# EAGLE board swift-nav (EAGLE 6.2), part 1 of 2
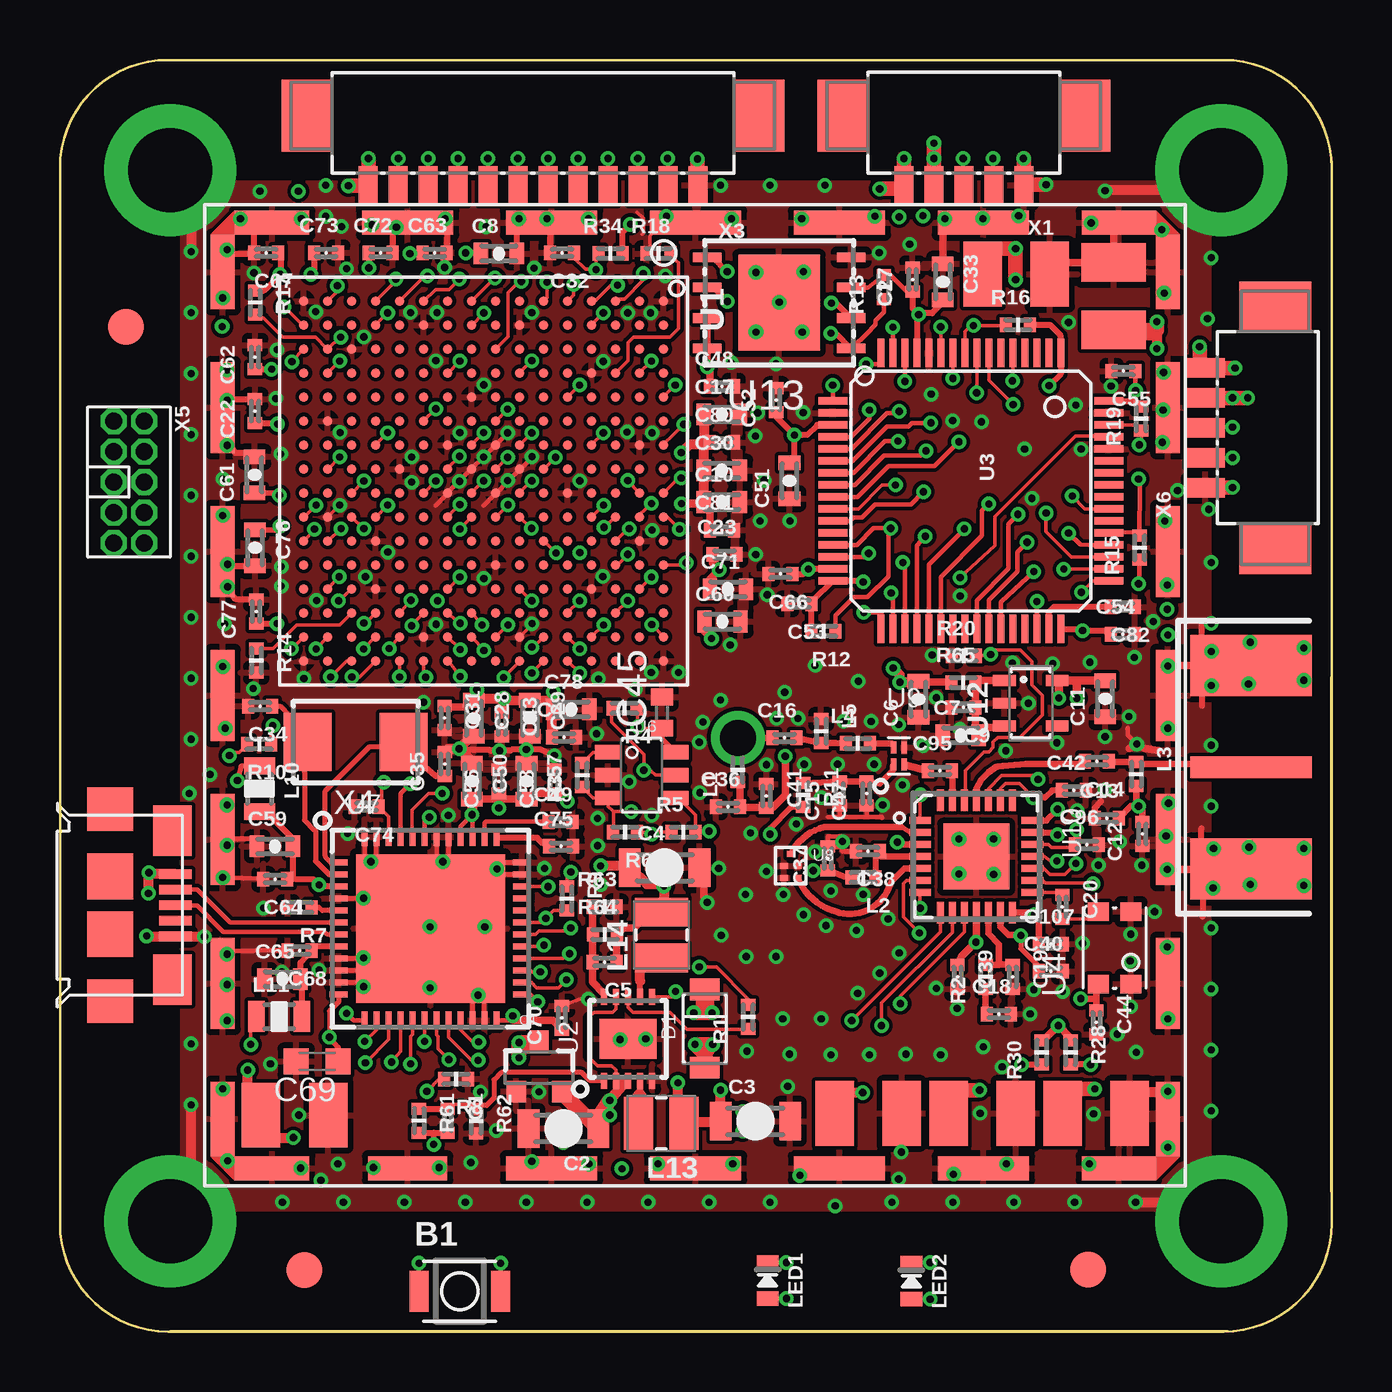
[diagram p7: board, top side]
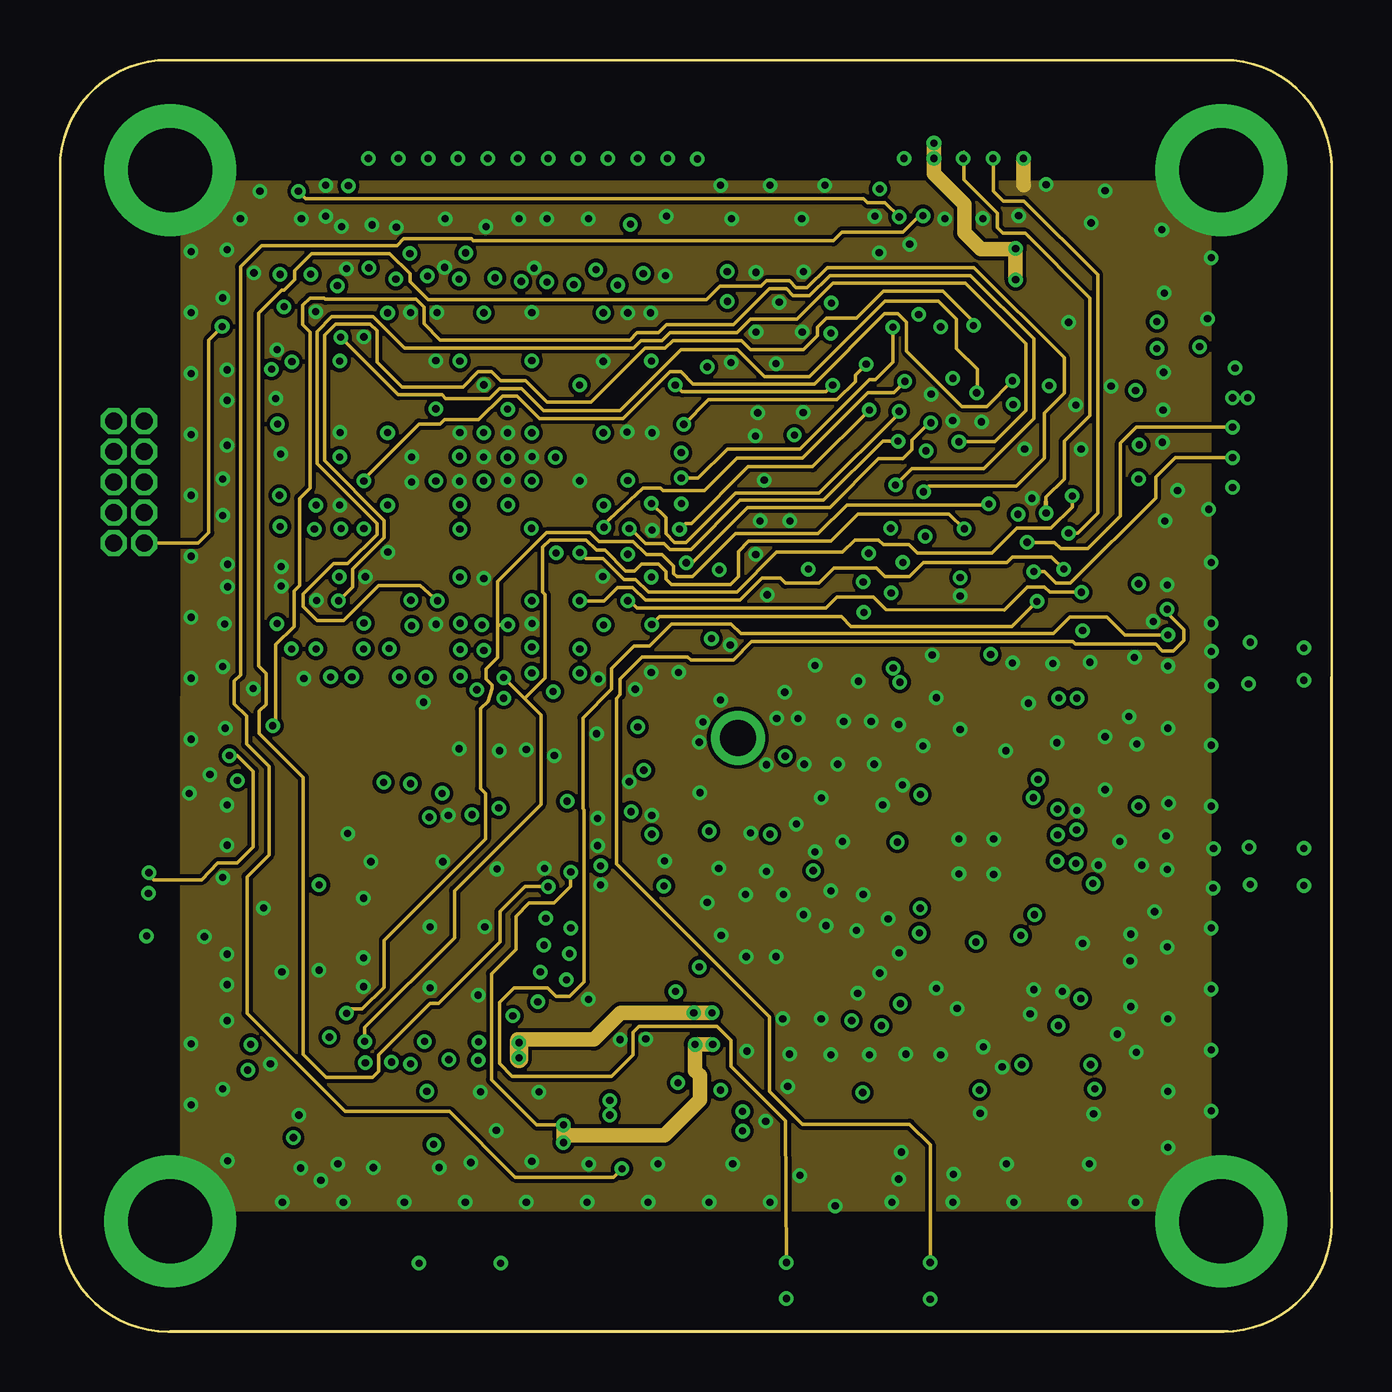
[diagram p8: board, inner layer Route2]
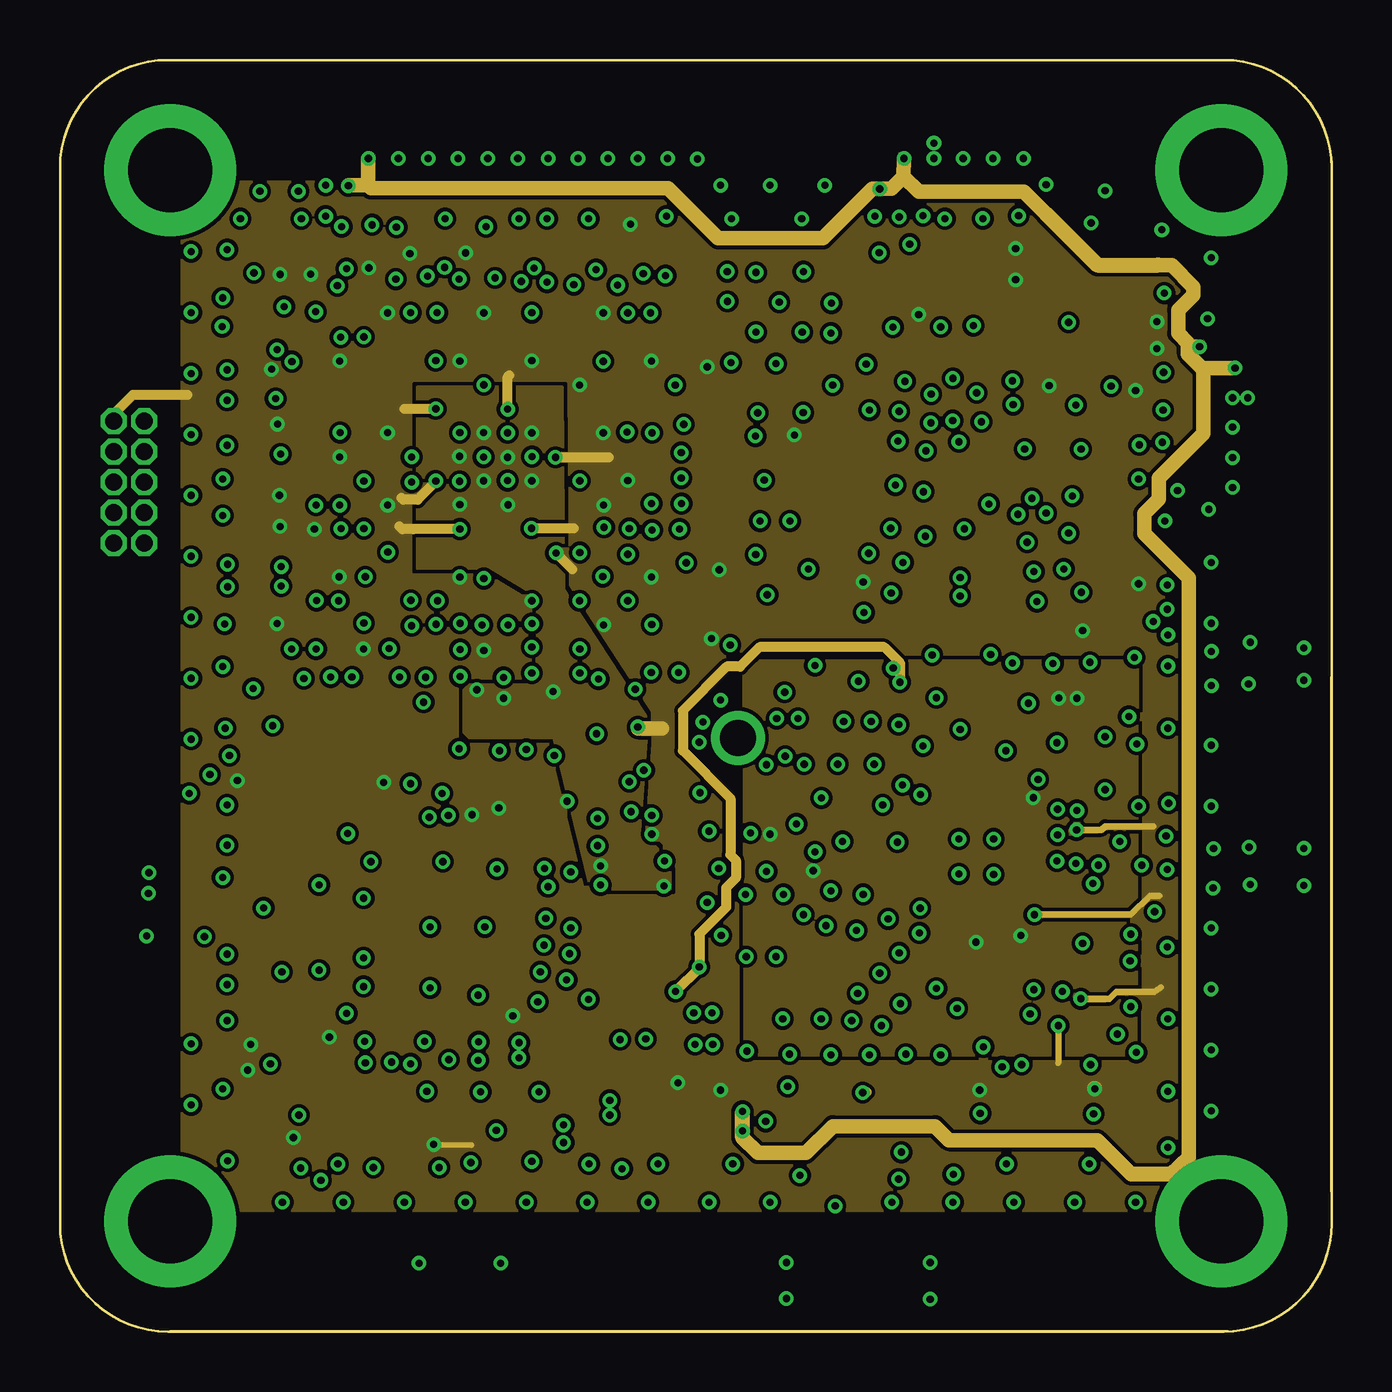
[diagram p9: board, inner layer Route3]
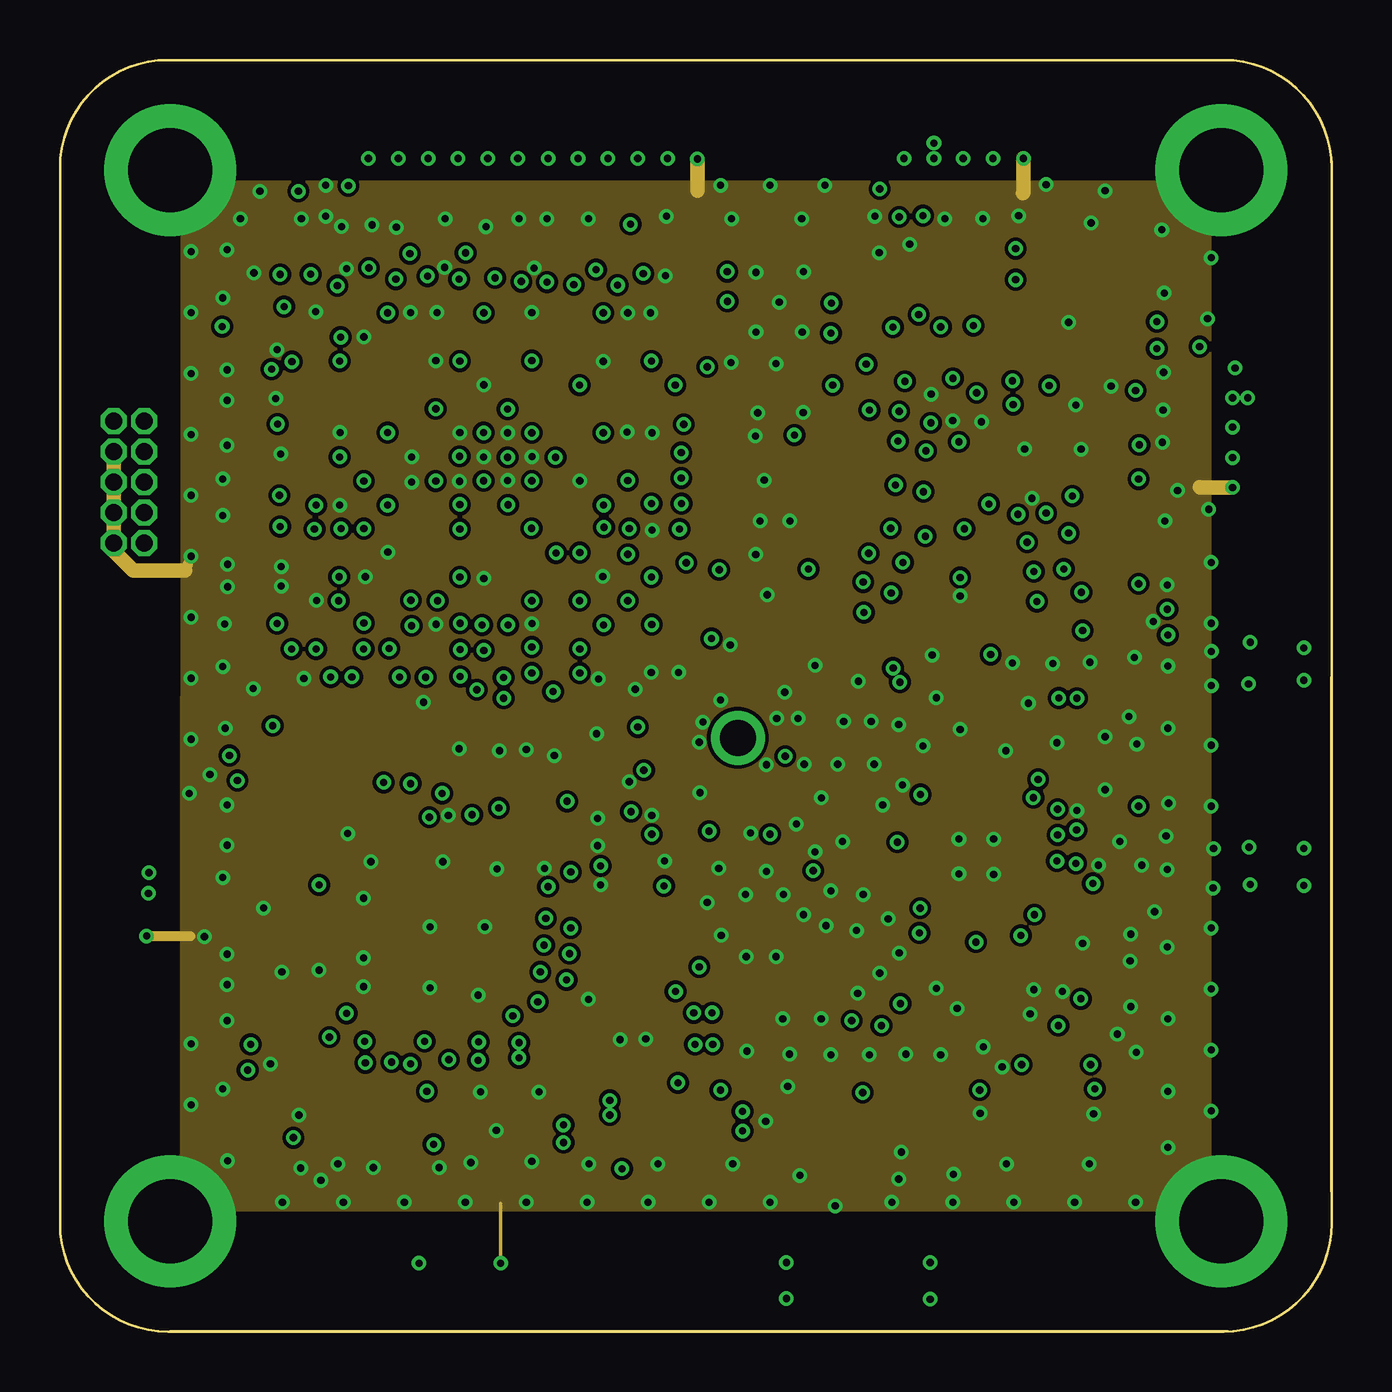
[diagram p10: board, inner layer Route14]
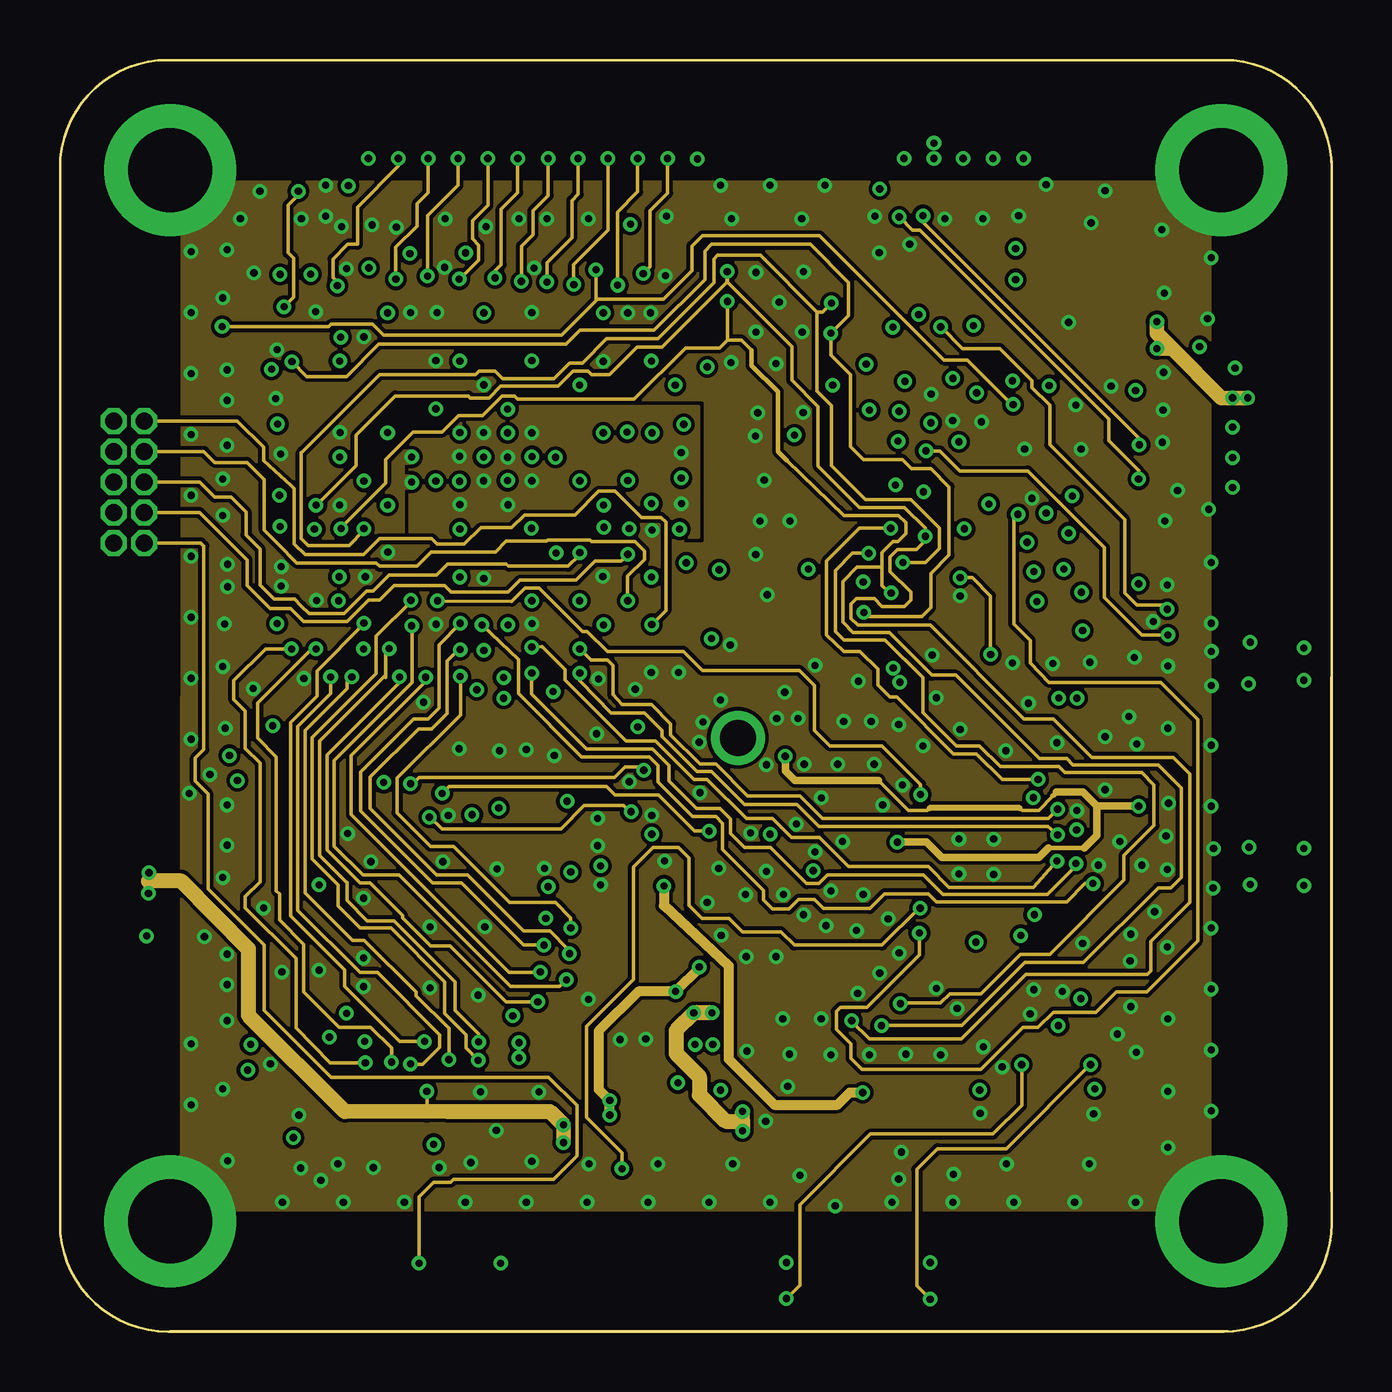
[diagram p11: board, inner layer Route15]
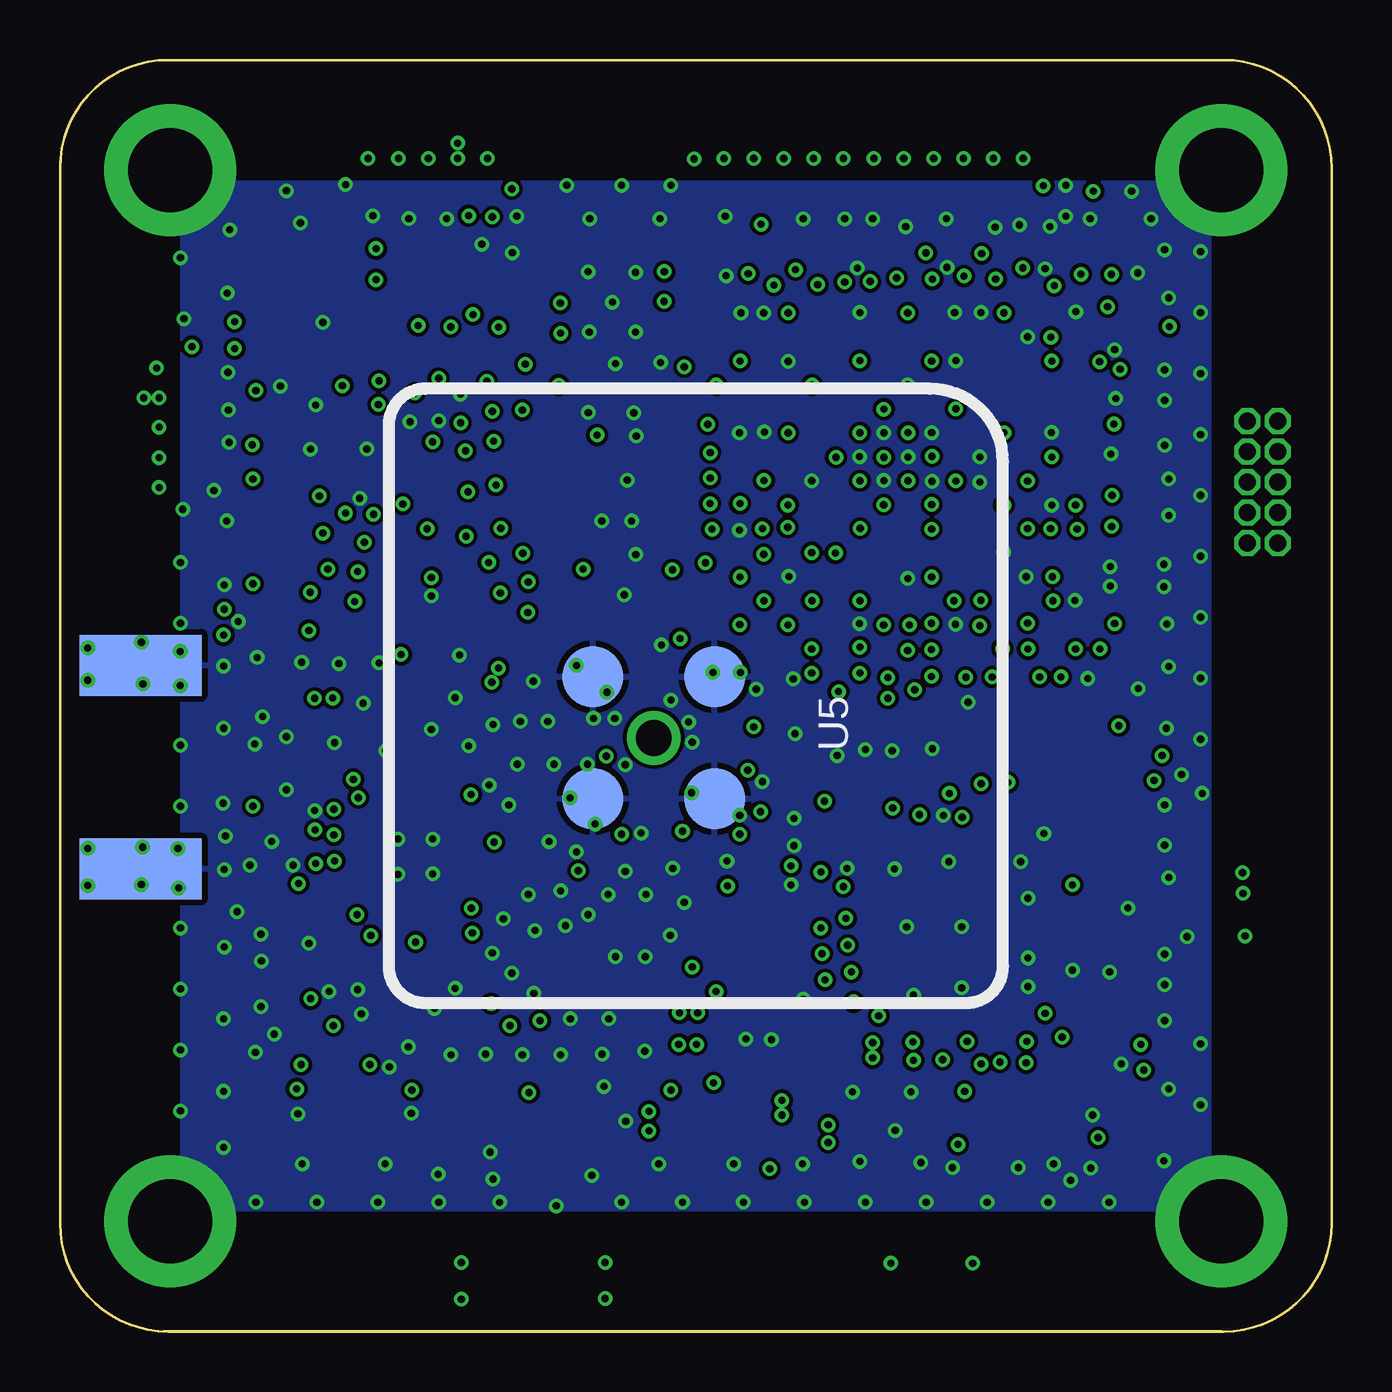
[diagram p12: board, bottom side, seen from below]

Size 53 x 53 mm. Coordinates in mm from the lower left corner, seen from the top.
Outline: 48.67,53 4.6,53
Outline: 0,47.3 0,5.86
Outline: 4.6,0 48.68,0
Outline: 53,5.85 53,48.76
Outline: 4.5,53 48.5,53 arc-90 53,48.5 53,4.5 arc-90 48.5,0 4.5,0 arc-90 0,4.5 0,48.5 arc-90 4.5,53
Copper layers (1+2*3+14*15+16): Top 0.0175mm / dielectric 0.15mm / Route2 0.0175mm / dielectric 0.5mm / Route3 0.0175mm / dielectric 0.15mm / Route14 0.0175mm / dielectric 0.5mm / Route15 0.0175mm / dielectric 0.15mm / Bottom 0.0175mm
Design rules: minimum track width 6mil, minimum drill 0.3mm, track to track 6mil, track to pad 6mil, pad to pad 6mil, via to via 6mil, smd to smd 6mil, copper to edge 30mil, drill to drill 8mil, minimum pad ring 7.5mil, minimum via ring 6mil, stop-mask expansion 3mil, vias tented up to drill 0.4mm, thermal gap 10mil

## Footprints (pad centres in the part's own frame; a part is rotated, then mirrored left to right if it is on the bottom)
B3U-1000P = smd 0.8 x 1.7: P$1 -1.7,0; P$2 1.7,0
0402-CAP = smd 0.5 x 0.6: P$1 -0.5,0; P$2 0.5,0
1206-CAP = smd 0.9 x 1.6: P$1 -1.45,0; P$2 1.45,0
0603-CAP = smd 0.6 x 0.9: P$1 -0.75,0; P$2 0.75,0
C1210 = smd 1.6 x 2.7: P$1 -1.4,0; P$2 1.4,0
C0402 = smd 0.7 x 0.9: 1 -0.65,0; 2 0.65,0
C0603K = smd 1.05 x 1.08: 1 -0.875,0; 2 0.875,0
SOD-123 = smd 0.914 x 1.219: 1 -1.626,0; 2 1.626,0
M3-PAD = drill 3.5 pad 5.5: B3,0 0,0
SMA_EDGE = smd 0.889 x 5.08: P1 0,-2.54 | smd 2.54 x 5.08: P2 -4.242,-2.54; P3 4.242,-2.54 | smd 2.54 x 5.08 bottom: P4 -4.242,-2.54; P5 4.242,-2.54
ZX62-B-5PA = smd 1.8 x 1.9: GND_LEFT -4,0; GND_RIGHT 4,0 | smd 1.9 x 1.9: GND_MID_LEFT -1.2,0; GND_MID_RIGHT 1.2,0 | smd 2.1 x 1.6: GND_UP_LEFT -3.1,2.6; GND_UP_RIGHT 3.1,2.6 | smd 0.4 x 1.35: PIN_1 -1.3,2.725; PIN_2 -0.65,2.725; PIN_3 0,2.725; PIN_4 0.65,2.725; PIN_5 1.3,2.725
FIDUCIAL-1.5X3 = smd 1.5 x 1.5: 1 0,0
0402-IND = smd 0.5 x 0.6: P$1 -0.5,0; P$2 0.5,0
0805-IND = smd 0.7 x 1.3: P$1 -0.95,0; P$2 0.95,0
LQM2HPN4R7MG0L = smd 1.2 x 2.2: 1 -0.95,0; 2 0.95,0
0603-LED = smd 0.6 x 0.9: A 0.75,0; C -0.75,0
SOT23-3 = smd 0.8 x 0.9: 1 -0.95,-1; 2 0.95,-1; 3 0,1.1
0402-RES = smd 0.5 x 0.6: P$1 -0.5,0; P$2 0.5,0
BMI-S-208 = smd 3.1 x 1: 1 2.55,0.5; 3 37.85,0.5; 7 37.85,39.9; 9 2.55,39.9 | smd 3.8 x 1: 2 8.2,0.5; 8 8.2,39.9; 13 14.2,0.5; 14 20.2,0.5; 15 26.2,0.5; 16 32.2,0.5; 25 14.2,39.9; 26 20.2,39.9; 27 26.2,39.9; 28 32.2,39.9 | smd 1 x 3.1: 4 39.9,2.55; 6 39.9,37.85; 10 0.5,37.85; 12 0.5,2.55 | smd 1 x 3.3: 5 39.9,8.2 | smd 1 x 3.8: 11 0.5,8.2; 17 39.9,14.2; 18 39.9,20.2; 19 39.9,32.2; 20 0.5,14.2; 21 39.9,26.2; 22 0.5,20.2; 23 0.5,26.2; 24 0.5,32.2
FT256 = smd 0.4 x 0.4: A1 -7.5,7.5; A2 -6.5,7.5; A3 -5.5,7.5; A4 -4.5,7.5; A5 -3.5,7.5; A6 -2.5,7.5; A7 -1.5,7.5; A8 -0.5,7.5; A9 0.5,7.5; A10 1.5,7.5; A11 2.5,7.5; A12 3.5,7.5; A13 4.5,7.5; A14 5.5,7.5; A15 6.5,7.5; A16 7.5,7.5; B1 -7.5,6.5; B2 -6.5,6.5; B3 -5.5,6.5; B4 -4.5,6.5; B5 -3.5,6.5; B6 -2.5,6.5; B7 -1.5,6.5; B8 -0.5,6.5; B9 0.5,6.5; B10 1.5,6.5; B11 2.5,6.5; B12 3.5,6.5; B13 4.5,6.5; B14 5.5,6.5; B15 6.5,6.5; B16 7.5,6.5; C1 -7.5,5.5; C2 -6.5,5.5; C3 -5.5,5.5; C4 -4.5,5.5; C5 -3.5,5.5; C6 -2.5,5.5; C7 -1.5,5.5; C8 -0.5,5.5; C9 0.5,5.5; C10 1.5,5.5; C11 2.5,5.5; C12 3.5,5.5; C13 4.5,5.5; C14 5.5,5.5; C15 6.5,5.5; C16 7.5,5.5; D1 -7.5,4.5; D2 -6.5,4.5; D3 -5.5,4.5; D4 -4.5,4.5; D5 -3.5,4.5; D6 -2.5,4.5; D7 -1.5,4.5; D8 -0.5,4.5; D9 0.5,4.5; D10 1.5,4.5; D11 2.5,4.5; D12 3.5,4.5; D13 4.5,4.5; D14 5.5,4.5; D15 6.5,4.5; D16 7.5,4.5; E1 -7.5,3.5; E2 -6.5,3.5; E3 -5.5,3.5; E4 -4.5,3.5; E5 -3.5,3.5; E6 -2.5,3.5; E7 -1.5,3.5; E8 -0.5,3.5; E9 0.5,3.5; E10 1.5,3.5; E11 2.5,3.5; E12 3.5,3.5; E13 4.5,3.5; E14 5.5,3.5; E15 6.5,3.5; E16 7.5,3.5; F1 -7.5,2.5; F2 -6.5,2.5; F3 -5.5,2.5; F4 -4.5,2.5; F5 -3.5,2.5; F6 -2.5,2.5; F7 -1.5,2.5; F8 -0.5,2.5; F9 0.5,2.5; F10 1.5,2.5; F11 2.5,2.5; F12 3.5,2.5; F13 4.5,2.5; F14 5.5,2.5; F15 6.5,2.5; F16 7.5,2.5; G1 -7.5,1.5; G2 -6.5,1.5; G3 -5.5,1.5; G4 -4.5,1.5; G5 -3.5,1.5; G6 -2.5,1.5; G7 -1.5,1.5; G8 -0.5,1.5; G9 0.5,1.5; G10 1.5,1.5; G11 2.5,1.5; G12 3.5,1.5; G13 4.5,1.5; G14 5.5,1.5; G15 6.5,1.5; G16 7.5,1.5; H1 -7.5,0.5; H2 -6.5,0.5; H3 -5.5,0.5; H4 -4.5,0.5; H5 -3.5,0.5; H6 -2.5,0.5; H7 -1.5,0.5; H8 -0.5,0.5; H9 0.5,0.5; H10 1.5,0.5; H11 2.5,0.5; H12 3.5,0.5; H13 4.5,0.5; H14 5.5,0.5; H15 6.5,0.5; H16 7.5,0.5; J1 -7.5,-0.5; J2 -6.5,-0.5; J3 -5.5,-0.5; J4 -4.5,-0.5; J5 -3.5,-0.5; J6 -2.5,-0.5; J7 -1.5,-0.5; J8 -0.5,-0.5; J9 0.5,-0.5; J10 1.5,-0.5; J11 2.5,-0.5; J12 3.5,-0.5; J13 4.5,-0.5; J14 5.5,-0.5; J15 6.5,-0.5; J16 7.5,-0.5; K1 -7.5,-1.5; K2 -6.5,-1.5; K3 -5.5,-1.5; K4 -4.5,-1.5; K5 -3.5,-1.5; K6 -2.5,-1.5; K7 -1.5,-1.5; K8 -0.5,-1.5; K9 0.5,-1.5; K10 1.5,-1.5; K11 2.5,-1.5; K12 3.5,-1.5; K13 4.5,-1.5; K14 5.5,-1.5; K15 6.5,-1.5; K16 7.5,-1.5; L1 -7.5,-2.5; L2 -6.5,-2.5; L3 -5.5,-2.5; L4 -4.5,-2.5; L5 -3.5,-2.5; L6 -2.5,-2.5; L7 -1.5,-2.5; L8 -0.5,-2.5; L9 0.5,-2.5; L10 1.5,-2.5; L11 2.5,-2.5; L12 3.5,-2.5; L13 4.5,-2.5; L14 5.5,-2.5; L15 6.5,-2.5; L16 7.5,-2.5; M1 -7.5,-3.5; M2 -6.5,-3.5; M3 -5.5,-3.5; M4 -4.5,-3.5; M5 -3.5,-3.5; M6 -2.5,-3.5; M7 -1.5,-3.5; M8 -0.5,-3.5; M9 0.5,-3.5; M10 1.5,-3.5; M11 2.5,-3.5; M12 3.5,-3.5; M13 4.5,-3.5; M14 5.5,-3.5; M15 6.5,-3.5; M16 7.5,-3.5; N1 -7.5,-4.5; N2 -6.5,-4.5; N3 -5.5,-4.5; N4 -4.5,-4.5; N5 -3.5,-4.5; N6 -2.5,-4.5; N7 -1.5,-4.5; N8 -0.5,-4.5; N9 0.5,-4.5; N10 1.5,-4.5; N11 2.5,-4.5; N12 3.5,-4.5; N13 4.5,-4.5; N14 5.5,-4.5; N15 6.5,-4.5; N16 7.5,-4.5; P1 -7.5,-5.5; P2 -6.5,-5.5; P3 -5.5,-5.5; P4 -4.5,-5.5; P5 -3.5,-5.5; P6 -2.5,-5.5; P7 -1.5,-5.5; P8 -0.5,-5.5; P9 0.5,-5.5; P10 1.5,-5.5; P11 2.5,-5.5; P12 3.5,-5.5; P13 4.5,-5.5; P14 5.5,-5.5; P15 6.5,-5.5; P16 7.5,-5.5; R1 -7.5,-6.5; R2 -6.5,-6.5; R3 -5.5,-6.5; R4 -4.5,-6.5; R5 -3.5,-6.5; R6 -2.5,-6.5; R7 -1.5,-6.5; R8 -0.5,-6.5; R9 0.5,-6.5; R10 1.5,-6.5; R11 2.5,-6.5; R12 3.5,-6.5; R13 4.5,-6.5; R14 5.5,-6.5; R15 6.5,-6.5; R16 7.5,-6.5; T1 -7.5,-7.5; T2 -6.5,-7.5; T3 -5.5,-7.5; T4 -4.5,-7.5; T5 -3.5,-7.5; T6 -2.5,-7.5; T7 -1.5,-7.5; T8 -0.5,-7.5; T9 0.5,-7.5; T10 1.5,-7.5; T11 2.5,-7.5; T12 3.5,-7.5; T13 4.5,-7.5; T14 5.5,-7.5; T15 6.5,-7.5; T16 7.5,-7.5
DFN10 = smd 0.25 x 0.68: 1 -1,-1.75; 2 -0.5,-1.75; 3 0,-1.75; 4 0.5,-1.75; 5 1,-1.75; 6 1,1.75; 7 0.5,1.75; 8 0,1.75; 9 -0.5,1.75; 10 -1,1.75 | smd 2.38 x 1.65: 11 0,0
LQFP64 = smd 1.2 x 0.3: 1 -5.75,3.75; 2 -5.75,3.25; 3 -5.75,2.75; 4 -5.75,2.25; 5 -5.75,1.75; 6 -5.75,1.25; 7 -5.75,0.75; 8 -5.75,0.25; 9 -5.75,-0.25; 10 -5.75,-0.75; 11 -5.75,-1.25; 12 -5.75,-1.75; 13 -5.75,-2.25; 14 -5.75,-2.75; 15 -5.75,-3.25; 16 -5.75,-3.75; 33 5.75,-3.75; 34 5.75,-3.25; 35 5.75,-2.75; 36 5.75,-2.25; 37 5.75,-1.75; 38 5.75,-1.25; 39 5.75,-0.75; 40 5.75,-0.25; 41 5.75,0.25; 42 5.75,0.75; 43 5.75,1.25; 44 5.75,1.75; 45 5.75,2.25; 46 5.75,2.75; 47 5.75,3.25; 48 5.75,3.75 | smd 0.3 x 1.2: 17 -3.75,-5.75; 18 -3.25,-5.75; 19 -2.75,-5.75; 20 -2.25,-5.75; 21 -1.75,-5.75; 22 -1.25,-5.75; 23 -0.75,-5.75; 24 -0.25,-5.75; 25 0.25,-5.75; 26 0.75,-5.75; 27 1.25,-5.75; 28 1.75,-5.75; 29 2.25,-5.75; 30 2.75,-5.75; 31 3.25,-5.75; 32 3.75,-5.75; 49 3.75,5.75; 50 3.25,5.75; 51 2.75,5.75; 52 2.25,5.75; 53 1.75,5.75; 54 1.25,5.75; 55 0.75,5.75; 56 0.25,5.75; 57 -0.25,5.75; 58 -0.75,5.75; 59 -1.25,5.75; 60 -1.75,5.75; 61 -2.25,5.75; 62 -2.75,5.75; 63 -3.25,5.75; 64 -3.75,5.75
TCX_7Q = smd 0.78 x 0.87: 1 -1.51,-0.68; 2 1.51,-0.68; 3 1.51,0.68; 4 -1.51,0.68
SMA_PATCH_SMDGND = drill 1.499: 1 1.753,-1.753 | smd 2.54 x 2.54: 2 -0.787,0.787; 3 -0.787,-4.293; 4 4.293,-4.293; 5 4.293,0.787
93AA56BT-I/OT = smd 0.6 x 1.1: 1 -0.95,-1.4; 2 0,-1.4; 3 0.95,-1.4; 4 0.95,1.4; 5 0,1.4; 6 -0.95,1.4
FT232HQ = smd 0.75 x 0.25: 1 -3.825,2.75; 2 -3.825,2.25; 3 -3.825,1.75; 4 -3.825,1.25; 5 -3.825,0.75; 6 -3.825,0.25; 7 -3.825,-0.25; 8 -3.825,-0.75; 9 -3.825,-1.25; 10 -3.825,-1.75; 11 -3.825,-2.25; 12 -3.825,-2.75; 25 3.825,-2.75; 26 3.825,-2.25; 27 3.825,-1.75; 28 3.825,-1.25; 29 3.825,-0.75; 30 3.825,-0.25; 31 3.825,0.25; 32 3.825,0.75; 33 3.825,1.25; 34 3.825,1.75; 35 3.825,2.25; 36 3.825,2.75 | smd 0.25 x 0.75: 13 -2.75,-3.825; 14 -2.25,-3.825; 15 -1.75,-3.825; 16 -1.25,-3.825; 17 -0.75,-3.825; 18 -0.25,-3.825; 19 0.25,-3.825; 20 0.75,-3.825; 21 1.25,-3.825; 22 1.75,-3.825; 23 2.25,-3.825; 24 2.75,-3.825; 37 2.75,3.825; 38 2.25,3.825; 39 1.75,3.825; 40 1.25,3.825; 41 0.75,3.825; 42 0.25,3.825; 43 -0.25,3.825; 44 -0.75,3.825; 45 -1.25,3.825; 46 -1.75,3.825; 47 -2.25,3.825; 48 -2.75,3.825 | smd 6.2 x 6.2: 49 0,0
SAW_1.4X1.1 = smd 0.325 x 0.25: 1 0,0.5; 2 -0.287,0; 3 -0.287,-0.5; 4 0.287,-0.5; 5 0.287,0
XC2401 = smd 0.229 x 0.508: 1 -0.229,-0.356; 2 0.229,-0.356; 3 0.229,0.356; 4 -0.229,0.356
MAX2769 = smd 0.3 x 0.9: 1 -1.5,-2.34; 2 -1,-2.34; 3 -0.5,-2.34; 4 0,-2.34; 5 0.5,-2.34; 6 1,-2.34; 7 1.5,-2.34; 15 1.5,2.34; 16 1,2.34; 17 0.5,2.34; 18 0,2.34; 19 -0.5,2.34; 20 -1,2.34; 21 -1.5,2.34 | smd 0.9 x 0.3: 8 2.34,-1.5; 9 2.34,-1; 10 2.34,-0.5; 11 2.34,0; 12 2.34,0.5; 13 2.34,1; 14 2.34,1.5; 22 -2.34,1.5; 23 -2.34,1; 24 -2.34,0.5; 25 -2.34,0; 26 -2.34,-0.5; 27 -2.34,-1; 28 -2.34,-1.5 | smd 2.75 x 2.75: 29 0,0
PT7M8206B33TA5EX = smd 0.45 x 0.95: 1 0.95,1.1; 2 0,1.1; 3 -0.95,1.1; 4 -0.95,-1.1; 5 0.95,-1.1
M25P80_MLP8 = smd 1.2 x 0.4: 1 -3,1.9; 2 -3,0.64; 3 -3,-0.64; 4 -3,-1.9; 5 3,-1.9; 6 3,-0.64; 7 3,0.64; 8 3,1.9 | smd 3.4 x 4: 9 0,0
PB-53261-05 = smd 0.8 x 1.6: 1 -2.5,1.1; 2 -1.25,1.1; 3 0,1.1; 4 1.25,1.1; 5 2.5,1.1 | smd 2.1 x 3: MNT1 -5.05,-1.8; MNT2 5.05,-1.8
PB-53261-12 = smd 0.8 x 1.6: 1 -6.875,1.1; 2 -5.625,1.1; 3 -4.375,1.1; 4 -3.125,1.1; 5 -1.875,1.1; 6 -0.625,1.1; 7 0.625,1.1; 8 1.875,1.1; 9 3.125,1.1; 10 4.375,1.1; 11 5.625,1.1; 12 6.875,1.1 | smd 2.1 x 3: MNT1 -9.425,-1.8; MNT2 9.425,-1.8
NX5032GA = smd 2 x 2.4: 1 -2,0; 2 2,0
FTSH-105-D = drill 0.71 pad 1.016 octagon: 1 -2.54,-0.635; 2 -2.54,0.635; 3 -1.27,-0.635; 4 -1.27,0.635; 5 0,-0.635; 6 0,0.635; 7 1.27,-0.635; 8 1.27,0.635; 9 2.54,-0.635; 10 2.54,0.635

## Placement (x,y rotation side)
B1  B3U-1000P  [B3U-1000P]  16.67,1.68 0 top
C1  22pF  [0402-CAP]  16.16,8.79 270 top
C2  10uF  [1206-CAP]  20.98,8.46 180 top
C3  10uF  [1206-CAP]  28.99,8.77 0 top
C4  10uF  [1206-CAP]  25.21,19.34 0 top
C5  22pF  [0402-CAP]  22.69,15.4 180 top
C6  4.7uF  [0603-CAP]  35.78,26.35 90 top
C7  4.7uF  [0603-CAP]  37.54,24.85 0 top
C8  4.7uF  [0603-CAP]  18.29,44.94 0 top
C9  0.047uF  [0402-CAP]  37.65,26.01 180 top
C10  4.7uF  [0603-CAP]  27.59,34.57 0 top
C11  4.7uF  [0603-CAP]  43.56,26.37 90 top
C12  100pF  [0402-CAP]  45.11,20.74 90 top
C13  0.47uF  [0402-CAP]  43.63,21.39 0 top
C14  100pF  [0402-CAP]  43.22,23.77 180 top
C15  0.047uF  [0402-CAP]  32.5,22.42 90 top
C16  100pF  [0402-CAP]  30.2,24.74 0 top
C17  4.7uF  [0603-CAP]  27.59,38.23 0 top
C18  470pF  [0402-CAP]  39.15,13.24 0 top
C19  27pF  [0402-CAP]  39.7,14.79 270 top
C20  0.047uF  [0402-CAP]  41.78,17.7 270 top
C21  100uF  [C1210]  9.78,9.02 0 top
C22  0.47uF  [0402-CAP]  8.13,38.36 90 top
C23  0.47uF  [0402-CAP]  27.69,32.39 0 top
C24  100uF  [C1210]  33.68,9.1 0 top
C25  100uF  [C1210]  39.86,44.07 0 top
C26  100uF  [C1210]  43.18,9.1 0 top
C27  0.047uF  [0402-CAP]  35.54,43.85 90 top
C28  4.7uF  [0603-CAP]  17.25,25.56 270 top
C29  4.7uF  [0603-CAP]  19.59,25.56 270 top
C30  4.7uF  [0603-CAP]  27.59,35.89 0 top
C31  0.47uF  [0402-CAP]  16.03,25.58 270 top
C32  0.47uF  [0402-CAP]  20.93,44.96 180 top
C33  4.7uF  [0603-CAP]  36.8,43.75 270 top
C34  20pF  [0402-CAP]  8.34,26.06 180 top
C35  20pF  [0402-CAP]  16.04,23.65 90 top
C36  100pF  [0402-CAP]  27.84,21.87 0 top
C37  100pF  [0402-CAP]  32.01,19.71 90 top
C38  12pF  [0402-CAP]  33.68,20.02 180 top
C39  0.47uF  [0402-CAP]  37.41,14.78 270 top
C40  0.47uF  [0402-CAP]  41.3,15.01 0 top
C41  0.47uF  [0402-CAP]  29.44,22.33 270 top
C42  0.47uF  [0402-CAP]  42.26,22.56 0 top
C43  0.47uF  [0402-CAP]  18.42,25.3 270 top
C44  0.47uF  [0402-CAP]  43.2,12.89 270 top
C45  0.047uF  [C0402]  25.09,25.8 90 top
C46  0.47uF  [0402-CAP]  21.01,24.77 0 top
C47  100pF  [0402-CAP]  33.62,22.42 90 top
C48  0.47uF  [0402-CAP]  27.59,39.4 0 top
C49  0.047uF  [0402-CAP]  20.87,21.24 0 top
C50  4.7uF  [0603-CAP]  17.17,22.94 270 top
C51  4.7uF  [0603-CAP]  30.41,35.46 90 top
C52  0.47uF  [0402-CAP]  29.85,38.81 90 top
C53  0.47uF  [0402-CAP]  30.81,30.33 180 top
C54  0.47uF  [0402-CAP]  44.3,29.06 0 top
C55  0.47uF  [0402-CAP]  44.33,40.03 180 top
C56  0.047uF  [0402-CAP]  18.3,22.94 90 top
C57  4.7uF  [0603-CAP]  19.45,22.94 270 top
C58  0.047uF  [0402-CAP]  20.6,22.94 90 top
C59  4.7uF  [0603-CAP]  8.97,20.22 0 top
C60  4.7uF  [0603-CAP]  27.61,29.59 0 top
C61  4.7uF  [0603-CAP]  8.11,35.71 90 top
C62  0.47uF  [0402-CAP]  8.13,40.62 90 top
C63  0.47uF  [0402-CAP]  15.62,44.96 0 top
C64  0.047uF  [0402-CAP]  8.97,18.86 180 top
C65  4.7uF  [0603-CAP]  9.27,14.69 0 top
C66  0.47uF  [0402-CAP]  30.03,31.58 180 top
C67  0.47uF  [0402-CAP]  8.59,44.96 180 top
C68  0.047uF  [0402-CAP]  9.99,15.88 180 top
C69  0.047uF  [C0603K]  10.72,11.26 180 top
C70  0.047uF  [0402-CAP]  20.92,13.08 90 top
C71  4.7uF  [0603-CAP]  27.84,30.94 0 top
C72  0.47uF  [0402-CAP]  13.36,44.96 0 top
C73  0.47uF  [0402-CAP]  11.1,44.96 0 top
C74  0.047uF  [0402-CAP]  12.78,21.87 180 top
C75  0.047uF  [0402-CAP]  20.88,20.22 0 top
C76  4.7uF  [0603-CAP]  8.13,32.67 270 top
C77  0.47uF  [0402-CAP]  8.18,30.01 90 top
C78  4.7uF  [0603-CAP]  21.31,25.94 0 top
C80  0.47uF  [0402-CAP]  27.59,37.06 0 top
C81  0.47uF  [0402-CAP]  27.59,33.4 0 top
C82  0.47uF  [0402-CAP]  44.3,30.2 180 top
C86  100uF  [C1210]  38.43,9.1 0 top
C87  100uF  [C1210]  43.92,43.16 90 top
C95  100pF  [0402-CAP]  36.67,23.37 0 top
C96  0.47uF  [0402-CAP]  42.79,20.29 0 top
C107  0.47uF  [0402-CAP]  41.3,16.15 0 top
D1  MBR0520  [SOD-123]  26.88,12.63 90 top
H2  MOUNT-PAD-ROUNDM3  [M3-PAD]  48.4,4.6 0 top
H3  MOUNT-PAD-ROUNDM3  [M3-PAD]  4.6,48.4 0 top
H4  MOUNT-PAD-ROUNDM3  [M3-PAD]  48.4,48.4 0 top
H5  MOUNT-PAD-ROUNDM3  [M3-PAD]  4.6,4.6 0 top
J1  SMA_EDGE  [SMA_EDGE]  52.19,23.52 270 top
J6  ZX62-B-5PA  [ZX62-B-5PA]  2.1,17.77 270 top
JP8  FIDUCIAL1.5X3  [FIDUCIAL-1.5X3]  42.85,2.59 90 top
JP9  FIDUCIAL1.5X3  [FIDUCIAL-1.5X3]  2.76,41.88 90 top
JP10  FIDUCIAL1.5X3  [FIDUCIAL-1.5X3]  10.18,2.56 90 top
L1  27nH / DNP  [0402-IND]  28.25,23.41 90 top
L2  27nH  [0402-IND]  33.48,18.93 180 top
L3  3.3nH  [0402-IND]  44.86,23.23 270 top
L4  5.1nH  [0402-IND]  33.25,24.51 0 top
L5  2nH  [0402-IND]  31.73,25.02 270 top
L10  Ferrite 600/0.5  [0805-IND]  8.32,22.62 270 top
L11  Ferrite 600/0.5  [0805-IND]  9.14,13.13 0 top
L13  4.7uH  [LQM2HPN4R7MG0L]  25.06,8.67 180 top
L14  4.7uH  [LQM2HPN4R7MG0L]  25.07,16.53 90 top
LED1  RED  [0603-LED]  29.49,2.13 270 top
LED2  GREEN  [0603-LED]  35.49,2.1 270 top
Q1  IRLML6401  [SOT23-3]  19.97,11 0 top
R1  10K  [0402-RES]  28.68,13.11 90 top
R2  20k  [0402-RES]  38.58,14.79 90 top
R3  2K  [0402-RES]  21.77,23.19 90 top
R4  10k  [0402-RES]  23.53,25.98 180 top
R5  10k  [0402-RES]  25.98,20.82 0 top
R6  10k  [0402-RES]  23.55,20.81 180 top
R7  12k  [0402-RES]  9.99,17.68 180 top
R8  10K  [0402-RES]  16.51,10.52 180 top
R9  10k  [0402-RES]  21.13,18.04 270 top
R10  10K  [0402-RES]  8.31,24.48 180 top
R11  600  [0402-RES]  30.98,22.36 270 top
R12  10k  [0402-RES]  31.83,29.19 180 top
R13  2K  [0402-RES]  34.34,43.54 90 top
R14  10K  [0402-RES]  8.18,27.97 270 top
R15  2K  [0402-RES]  45,32.67 90 top
R16  330  [0402-RES]  39.93,41.96 0 top
R17  2K  [0402-RES]  8.14,42.89 270 top
R18  2K  [0402-RES]  24.95,44.94 0 top
R19  10k  [0402-RES]  45.06,38.05 90 top
R20  10k  [0402-RES]  37.67,28.17 0 top
R28  150  [0402-RES]  42.12,11.64 270 top
R30  910  [0402-RES]  40.92,11.64 90 top
R34  DNP  [0402-RES]  22.94,44.94 0 top
R61  634K  [0402-RES]  14.96,8.79 270 top
R62  140K  [0402-RES]  17.35,8.77 270 top
R63  200k  [0402-RES]  22.7,17.7 0 top
R64  200k  [0402-RES]  22.71,16.55 0 top
R65  10  [0402-RES]  37.65,27.05 0 top
SHLD2  BMI-S-208  [BMI-S-208]  6.29,46.71 270 top
U1  6SLX9FTG256  [FT256]  17.67,35.46 270 top
U2  LTC3407A_DFN  [DFN10]  23.68,12.2 0 top
U3  STM32-M-64-LQFP  [LQFP64]  37.96,35.04 270 top
U4  7Q-16.368MBG-T  [TCX_7Q]  43.96,15.99 90 top
U5  SMA_PATCH_SMDGND  [SMA_PATCH_SMDGND]  26.5,26.5 270 bottom
U6  93LC56BT-I/OT  [93AA56BT-I/OT]  24.25,23.19 270 top
U7  FT232HQ  [FT232HQ]  15.44,16.79 0 top
U8  SAW_1.4X1.1  [SAW_1.4X1.1]  30.46,19.41 0 top
U9  XC2401  [XC2401]  34.97,23.99 0 top
U10  MAX2769  [MAX2769]  38.19,19.8 270 top
U12  PT7M8206B33TA5EX  [PT7M8206B33TA5EX]  40.47,26.19 90 top
U13  M25PX80  [M25P80_MLP8]  29.98,42.88 180 top
U$1  LOGOINITIALS  [INITIALS]  20.27,20.91 0 bottom
U$2  LOGOLOGO3_SMALL  [LOGO3_SMALL]  24.2,1.35 0 top
X1  [PB-53261-05]  37.67,48.88 180 top
X3  FPGA DEBUG  [PB-53261-12]  19.71,48.87 180 top
X4  NX5032GA-12M  [NX5032GA]  12.33,24.57 180 top
X5  CONN_5-2  [FTSH-105-D]  2.87,35.41 270 top
X6  [PB-53261-05]  48.85,37.67 90 top

## Tracks (layer width: path | path; a pad name or v marks a point on that pad's centre or on a via)
DEBUG0  (via drill 0.3)
  Top 0.152: U1.R1 11.56,43.35 v11.56,43.59 | v14.1,48.9 14.1,47.79 X3.11
  Route15 0.152: 11.56,43.62 v11.56,43.59 11.56,43.74 11.38,43.92 11.38,44.71 11.99,45.32 12.4,45.32 12.4,46.87 14.1,48.57 v14.1,48.9
DEBUG1  (via drill 0.3)
  Top 0.152: U1.N1 14,43.79 v14,43.87 | v15.35,48.9 X3.10
  Route15 0.152: v14,43.87 14,45.19 14.89,46.08 14.89,47.02 15.35,47.48 v15.35,48.9
DEBUG2  (via drill 0.3)
  Top 0.152: 15.29,44 v15.32,44 15.21,44 U1.M1 | v16.59,48.9 X3.9
  Route15 0.152: v15.32,44 15.32,46.5 X3.9 16.59,48.92 v16.59,48.9
DEBUG3  (via drill 0.3)
  Top 0.152: U1.L1 15.65,43.44 16.21,43.44 v16.64,43.87 | v17.83,48.9 X3.8
  Route15 0.152: v17.83,48.9 17.83,46.94 17.2,46.31 17.2,45.55 17.45,45.29 17.45,44.66 16.67,43.87 v16.64,43.87
DEBUG4  (via drill 0.3)
  Top 0.152: U1.J1 v18.13,43.92 18.17,43.82 | v19.08,48.9 19.08,47.78 X3.7
  Route15 0.152: v18.13,43.92 18.13,44.22 18.39,44.48 18.39,46.79 19.08,47.48 v19.08,48.9
DEBUG5  (via drill 0.3)
  Top 0.152: U1.H3 18.67,41.46 18.67,43.31 19.13,43.77 v19.23,43.77 | v20.35,48.9 20.35,47.78 X3.6
  Route15 0.152: v19.23,43.77 19.23,45.24 19.71,45.72 19.71,46.71 20.35,47.35 v20.35,48.9
DEBUG6  (via drill 0.3)
  Top 0.152: v21.59,48.9 X3.5 | U1.F1 20.3,43.09 v20.3,43.74
  Route15 0.152: 20.17,43.77 v20.3,43.74 20.3,44.55 21.34,45.6 21.34,47.15 21.59,47.4 v21.59,48.9
DEBUG7  (via drill 0.3)
  Top 0.152: U1.E1 21.42,43.21 v21.42,43.64 | v22.84,48.9 X3.4
  Route15 0.152: 21.42,43.62 v21.42,43.64 21.42,44.48 22.84,45.9 v22.84,48.9
DEBUG8  (via drill 0.3)
  Top 0.152: U1.D1 22.31,42.95 22.97,43.62 v23.25,43.62 | v24.08,48.9 X3.3
  Route15 0.152: v23.25,43.62 23.25,46.66 24.08,47.5 v24.08,48.9
DEBUG9  (via drill 0.3)
  Top 0.152: U1.C1 23.24,43.03 23.52,43.03 24.31,43.82 v24.31,44.1 | v25.33,48.9 25.34,48.89 X3.2
  Route15 0.152: v24.31,44.1 24.59,44.38 24.59,46.71 25.33,47.45 v25.33,48.9
FE_CLK
  Top 0.152: C20.P$2 42.97,17.2 U4.3
FPGA_DONE  (via drill 0.3)
  Top 0.152: U3.9 37.71,41.68 37.97,41.93 v38.07,41.93 39.2,41.93 R16.P$1 | U1.P13 12.17,30.95 v11.61,30.46
  Route2 0.152: 11.51,30.46 v11.61,30.46 12.2,31.04 12.2,31.78 13.52,33.1 13.52,33.81 11.03,36.3 11.03,41.53 11.48,41.99 12.93,41.99 13.21,41.71 13.21,40.41 14.25,39.37 16.79,39.37 17.43,40.01 17.99,40.01 18.37,39.63 19.41,39.63 20.3,38.74 22.13,38.74 24.39,41 25.23,41 25.56,41.3 28.4,41.3 28.78,40.92 30.99,40.92 31.58,41.51 31.58,41.86 31.96,42.24 33.2,42.24 34.32,43.36 36.81,43.36 38.08,42.09 38.07,42.09 v38.07,41.93
FPGA_INIT_B  (via drill 0.3)
  Top 0.152: U3.8 38.21,39.78 v38.21,39.12 | v11.7,41.44 U1.R3 11.15,40.96 10.65,41.46 9.28,41.46 8.49,42.24 R17.P$2
  Route2 0.152: 11.74,41.44 v11.7,41.44 14.1,39.04 15.93,39.04 16.08,38.89 17.91,38.89 18.32,39.3 19.23,39.3 20.15,38.38 23.35,38.38 25.89,40.92 28.25,40.92 29.37,39.8 31.25,39.8 34.4,42.95 36.61,42.95 37.37,42.19 37.37,40.97 38.23,40.11 38.23,39.15 v38.21,39.12
FPGA_PROGRAM_B  (via drill 0.3)
  Top 0.152: U1.T2 10.09,41.97 v9.34,42.71
  Top 0.178: U3.53 43.74,33.32 44.94,33.3 45,33.24 R15.P$2 45.01,35.23 45.01,35.49 v44.96,35.54
  Route2 0.152: v9.94,47.53 10.24,47.22 33.48,47.22 33.66,47.04 34.4,47.04 v34.98,46.46 34.95,46.46
  Route15 0.152: v34.98,46.46 35.54,45.9 35.84,45.9 43.72,38.03 43.72,37.14 44.96,35.89 v44.96,35.54 | v9.34,42.71 9.73,43.11 9.73,44.73 9.5,44.96 9.5,46.94 9.94,47.38 v9.94,47.53
FPGA_TDO_STM_TDI  (via drill 0.3)
  Top 0.152: U1.E14 v21.66,30.46 | v41.84,31.78 U3.50
  Route2 0.152: 21.66,30.47 v21.66,30.46 22.69,30.46 23.25,31.02 23.87,31.02 24.4,30.48 28.35,30.48 29.26,31.4 30.03,31.4 30.23,31.2 31.63,31.2 32.26,31.83 34.04,31.83 34.4,31.47 35.41,31.47 36,32.06 39.48,32.06 39.7,32.29 41.33,32.29 v41.84,31.78
FTDI_ADBUS2  (via drill 0.3)
  Top 0.152: U7.15 13.69,12.17 v12.73,11.21 | U1.T15 v9.66,28.45
  Route15 0.152: 12.75,11.21 v12.73,11.21 11.26,11.21 9.83,12.65 9.83,15.55 7.73,17.66 7.73,18.14 8.34,18.75 8.34,23.7 7.73,24.31 7.73,25.86 7.24,26.34 7.24,27.13 8.56,28.45 v9.66,28.45
FTDI_ADBUS3  (via drill 0.3)
  Top 0.152: U7.16 14.19,11.68 v13.82,11.23 | U1.R15 11.17,28.95 v10.67,28.45
  Route15 0.152: 13.75,11.26 v13.82,11.23 13.82,11.81 12.96,12.68 11.64,12.68 10.16,14.15 10.16,16.13 9.15,17.15 9.15,18.24 9.02,18.37 9.02,23.96 8.23,24.74 8.23,26.19 10.49,28.45 v10.67,28.45
FTDI_ADBUS4  (via drill 0.3)
  Top 0.152: U7.17 14.69,12.38 14.61,12.3 v14.61,11.15 | v11.28,27.28 11.96,27.96 U1.P16
  Route15 0.152: v11.28,27.28 11.28,26.6 9.91,25.23 9.91,17.55 12.5,14.96 13.24,14.96 15.83,12.37 15.83,11.84 15.12,11.13 14.63,11.13 v14.61,11.15
FTDI_ADBUS5  (via drill 0.3)
  Top 0.152: U7.18 15.19,12.55 v15.19,12.09 | v12.67,29.53 12.74,29.53 U1.N14
  Route15 0.152: 12.67,29.56 v12.67,29.53 12.67,29.48 10.72,27.54 10.72,26.5 9.61,25.38 9.61,17.33 11.87,15.07 11.87,14.38 14.15,12.09 v15.19,12.09
FTDI_ADBUS6  (via drill 0.3)
  Top 0.152: v12.17,27.28 12.49,27.28 U1.N16 | U7.19 15.69,12.36 15.75,12.3 15.75,11.79 v16.21,11.33
  Route15 0.152: v16.21,11.33 16.21,12.63 14.84,14 14.84,14.15 12.68,16.31 12.2,16.31 10.21,18.29 10.21,25.05 11.97,26.8 11.97,27.08 v12.17,27.28
FTDI_ADBUS7  (via drill 0.3)
  Top 0.152: U7.20 16.19,12.26 17.15,11.31 v17.43,11.31 | U1.M14 v14.62,30.48
  Route15 0.152: v14.62,30.48 14.66,30.46 13.19,28.98 13.19,27.43 10.52,24.77 10.52,19.69 11.59,18.62 11.59,17.73 12.5,16.82 13.8,16.82 16.03,14.58 16.03,13.26 16.92,12.37 16.92,11.81 v17.43,11.31
FTDI_CLKOUT  (via drill 0.3)
  Top 0.152: U1.K14 v16.68,29.52 | U7.29 20.11,16.04 v20.17,16.11
  Route15 0.152: v16.68,29.52 15.8,28.62 15.8,25.99 15.35,25.53 14.74,25.53 12.53,23.32 12.53,21.7 15.52,18.7 16.74,18.7 19.33,16.11 v20.17,16.11
FTDI_NOE  (via drill 0.3)
  Top 0.152: U7.30 19.82,16.54 19.97,16.69 21.11,16.69 v21.29,16.82 | U1.K16 16.21,27.96 v16.68,27.31
  Route15 0.152: 16.67,27.52 16.68,27.51 v16.68,27.31 16.69,27.47 16.69,25.71 14.05,23.07 14.05,21.62 15.45,20.22 16.41,20.22 18.75,17.89 20.65,17.89 21.29,17.25 v21.29,16.82
FTDI_NRD  (via drill 0.3)
  Top 0.152: U7.26 19.65,14.54 19.87,14.33 20.78,14.33 v21.11,14.66 | v14.66,29.42 14.68,29.47 U1.L14
  Route15 0.152: v14.66,29.42 14.66,29.45 14.69,29.43 14.69,27.05 11.43,23.8 11.43,20.22 12.63,19.03 14.13,19.03 18.77,14.38 20.83,14.38 v21.11,14.66
FTDI_NRST  (via drill 0.3)
  Top 0.152: U7.34 v20.35,18.54 v20.35,18.55
  Top 0.178: U3.27 32.93,33.79 33.07,33.94 33.43,33.94 33.96,34.47 35.46,34.47 v36,35.01
  Route2 0.152: v20.35,18.55 20.37,18.55 | v20.35,18.55 20.35,18.42 20.37,18.52 | v36,35.01 36.22,35.23 39.86,35.23 41.03,36.4 41.03,38.28 41.86,39.12 41.86,40.59 38.1,44.35 31.98,44.35 31.14,43.51 30.69,43.51 30.41,43.79 29.44,43.79 29.21,43.57 27.51,43.57 26.95,43.01 15.35,43.01 14.58,43.77 14.58,44.1 13.75,44.94 10.49,44.94 9.78,44.23 9.78,43.84 9.35,43.41 9.25,43.41 8.28,42.45 8.28,27.74 8.59,27.44 8.59,26.14 8.31,25.86 8.31,24.92 10.14,23.09 10.14,11.56 11.1,10.59 13.03,10.59 13.29,10.85 13.29,11.54 15.42,13.67 15.78,13.67 18.34,16.23 18.34,17.5 19.38,18.55 v20.35,18.55
FTDI_NRXF  (via drill 0.3)
  Top 0.152: U7.21 16.69,12.58 17.2,12.07 v17.45,12.07 | v13.72,28.46 13.75,28.51 U1.M15
  Route15 0.152: v17.45,12.07 17.45,12.4 16.46,13.39 16.46,14.58 13.92,17.12 12.81,17.12 11.97,17.96 11.97,18.72 11.94,18.72 10.82,19.84 10.82,24.62 13.57,27.36 | 13.64,28.46 v13.72,28.46 13.72,28.48 13.57,28.33 13.57,27.36 | 13.57,27.25 13.57,27.36
FTDI_NSIWU  (via drill 0.3)
  Top 0.152: U7.28 20.98,15.54 21.01,15.57 v21.24,15.75 | v16.68,28.43 16.65,28.48 U1.K15
  Route15 0.152: v21.24,15.75 21.16,15.96 20.43,16.69 19.33,16.69 17,19.03 15.7,19.03 12.93,21.8 12.93,23.12 14.94,25.12 15.5,25.12 16.13,25.76 16.13,27.94 16.65,28.46 v16.68,28.43
FTDI_NTXE  (via drill 0.3)
  Top 0.152: U7.25 19.63,14.04 v19.92,13.74 | v14.15,27.28 14.15,27.94 U1.M16
  Route15 0.152: v14.15,27.28 14.15,27.21 | 14.15,27.33 v14.15,27.28 | v19.92,13.74 18.6,13.74 16.26,16.08 15.45,16.08 14.28,17.25 14.28,17.35 12.93,18.7 12.5,18.7 11.13,20.07 11.13,24.03 14.13,27.03 14.13,27.26 v14.15,27.28
FTDI_NWR  (via drill 0.3)
  Top 0.152: U7.27 19.61,15.04 19.66,14.99 v20.02,14.99 20.15,14.99 | U1.L16 15.17,27.35 v15.24,27.27
  Route15 0.152: v15.24,27.27 15.24,27.08 15.2,27.06 12.15,24.01 12.15,21.54 18.72,14.96 19.99,14.96 v20.02,14.99
GND  (via drill 0.3)
  Top 0.152: 6.79,13.47 SHLD2.16 | U1.R6 | U1.L2 15.17,41.98 | U1.G2 19.17,41.98 | U1.A1 | 6.98,21.94 v6.97,21.95 v6.96,21.95 | 24.25,45.75 24.32,45.76 24.32,46.41 24.05,46.65 | v22.03,13.85 21.92,13.96 C70.P$2 | R18.P$1 24.52,45 24.52,45.16 24.59,45.22 24.59,45.67 25.18,46.28 | U1.R10 v11.66,34.45 | U1.G15 19.68,29.47 v19.68,29.51 | U10.29 | B1.P$2 v18.37,2.85 | U8.5 30.75,19.44 31.09,19.79 | U1.P3 | U1.T1
  Top 0.178: v44.89,24.49 44.5,24.87 44.5,25.15 44.48,25.12 | 28.72,31.18 C71.P$2 | C72.P$2 13.94,45.12 13.95,44.96 | U7.9 12.88,15.54 12.88,15.52 | U7.10 12.86,15.04 12.86,15.07 | U7.11 12.93,14.54 12.93,14.58 | U7.22 17.2,14 | U7.23 17.68,14.05 | U7.36 18.27,19.54 | U7.35 18.34,19.04 18.34,19.08 | U7.48 12.7,20.62 12.7,19.51 | U7.47 13.19,19.49 | U7.42 15.69,19.43 v15.96,19.59 | U7.41 16.19,19.55 16.21,19.54 15.88,19.54 15.42,19.08 | U7.4 13.08,18.04 13.09,18.04 | 44.94,24.44 44.94,24.41 | v18.66,37.46 U1.K9 16.17,34.94 15.65,34.42 | 18.66,35.42 18.19,34.96 U1.H9 18.17,34.93 17.66,34.42 | 19.17,35.93 19.19,35.96 | v18.66,35.48 18.66,35.42 | 19.17,35.93 U1.G8 19.19,35.96 | 19.17,35.93 18.66,35.42 | 19.19,35.96 19.69,36.45 | C15.P$1 32.52,21.92 32.52,21.44 | 32.52,21.44 32.01,21.44 | 32.52,21.44 33.63,21.44 | 33.63,21.44 34.27,21.44 34.27,21.42 | C47.P$1 33.63,21.92 33.63,21.44 | C37.P$2 32.01,20.63 32.57,20.63 32.57,20.65
  Top 0.203: C64.P$2 6.77,18.91 6.76,19.18 | C68.P$2 6.73,15.85 6.76,14.13 | 6.81,12.8 6.76,12.75 | 6.98,21.94 6.96,21.92 | 13.08,18.04 13.08,19.1 v12.96,19.59 | 6.93,26.16 6.74,26.04 | 6.72,27.24 6.71,27.23 | C67.P$2 7.91,45.05 7.95,45.09 8.01,44.94 | C59.P$1 8,20.53 7.4,20.53 7.29,20.53 v6.96,20.27 | C37.P$2 32.64,20.21 v32.62,20.43 32.62,20.02 C38.P$2
  Top 0.254: v13.01,46.13 13.64,46.21 13.87,45.83 13.87,45.01 13.95,44.96 | v16.06,46.38 15.93,46.08 16.13,45.72 16.13,45.37 16.11,45.19 16.13,45.21 C63.P$2 | 19.18,45.22 19.03,45.24 19.03,45.83 18.98,46 v19.13,46.38 19.97,46.21 20.43,45.85 20.43,45.11 20.35,45.04 | v25.28,46.49 25.18,46.28 25.02,46.21 | 8.08,45.83 8.08,45.05 C67.P$2 | SHLD2.1 6.79,44.73 7.17,44.94 8.01,44.94 7.98,45.09 | v6.96,38.82 6.79,39.17 7.09,38.87 7.93,38.87 8.01,38.79 | v6.96,36.94 6.96,37.06 7.14,36.88 7.14,36.86 7.29,36.63 7.85,36.63 | v6.99,31.04 6.86,30.97 | 6.86,30.97 6.96,30.97 7.29,30.53 8.06,30.53 | 6.86,30.97 6.86,31.42 7.12,31.91 8.16,31.91 | 6.79,28.05 6.79,27.59 | 19.63,6.8 19.61,6.79 | v19.68,29.51 19.65,29.45 | v15.68,29.48 15.68,29.47 | U1.A16 25.11,27.96 | v22.62,31.47 22.66,31.47 | 47.6,26.09 47.6,27.1 v47.99,28.35 47.6,27.87 47.6,29.54 | v48.09,20.14 48.08,20.15 47.78,20.15 47.58,20.35 47.58,20.98 | v48.06,18.49 v48.05,18.5 47.93,18.5 47.63,18.19 47.63,17.3 | v20.6,24.01 20.04,24.26 v19.44,24.26 18.83,24.26 18.77,24.21 v18.32,24.21 17.96,24.21 17.94,24.24 16.64,24.24
  Top 0.279: C13.P$1 43.13,21.82 43.39,22.1
  Top 0.305: v26.98,17.89 26.98,17.96 26.85,18.09 26.85,19.21 26.67,19.38 | v46.16,19.26 47.58,19.26 47.63,19.71 | SHLD2.26 46.19,26.7 46.38,27.77 47.3,27.77 47.35,27.79 | 43.84,46.26 43.92,46.18 C87.P$2 41.38,44.56 41.3,44.73 | 45.77,24.21 45.22,24.31 44.94,24.44 v44.89,24.49 44.58,24.31 | v11.66,34.45 | 17.01,24.6 17.16,24.76 17.25,24.85 | C33.P$1 36.8,45.99 36.81,46
  Top 0.406: v37.47,19.08 U10.29 | 17.2,14 17.4,14 v17.43,14.02 | C26.P$2 44.58,9.55 45.01,9.99 46.16,9.99 v46.18,10.01 | v48.86,35.17 v48.87,35.18 | X3.1 26.57,47.79 | v3.61,16.49 3.64,16.46 v6.02,16.46 | C35.P$2 16.18,24.3 v16.64,24.3 | v16.64,24.3 17.1,24.76 17.16,24.76 | v16.64,24.3 17.15,23.79 17.15,23.68 | v44.84,5.39 48.4,5.39 H2.B3,0 | H5.B3,0 5.39,4.6 5.39,5.5 5.47,5.5 v5.47,9.45 | H3.B3,0 5.47,48.4 v5.47,45.01 | H4.B3,0 47.24,48.4 47.24,47.57 43.57,47.57 v43.57,47.55 | v49.56,20.19 49.61,20.19 v49.61,18.64 | v49.61,18.64 51.85,18.64 | 51.85,18.64 v51.85,18.59 | 51.85,18.64 v51.85,20.14 | v49.61,18.64 49.75,18.64 J1.P5 | v51.85,28.49 v51.85,27.14 49.75,27.14 | v49.55,26.99 49.55,27.14 49.75,27.14 | 49.75,27.14 J1.P4 49.61,27.77 v49.61,28.73
  Top 0.61: X6.1 v48.86,35.17 | 26.57,47.79 v26.57,48.87 | X1.1 40.17,48.91 v40.16,48.9 | v41.1,47.81 40.21,47.81
  Route2 0.61: v40.16,48.9 40.16,47.79 X1.1
  Route14 0.152: v18.37,2.85 18.37,5.34
  Route14 0.406: 5.31,31.98 5.34,31.98 5.21,31.73 | 2.24,32.54 X5.9 | v3.61,16.49 5.44,16.49
  Route14 0.61: 5.21,31.73 3.05,31.73 2.24,32.54 | X5.9 X5.7 X5.5 X5.3 | v40.16,48.9 40.16,47.48 40.14,47.45 | v48.87,35.18 47.53,35.18 47.5,35.21 | v26.57,48.87 26.57,47.55
  other vias: 35.97,24.41 41.38,27.84 44.78,28.1 46.1,20.65 41.79,14.18 42.62,16.18 45.62,17.5 44.61,15.45 44.86,11.64 37.39,13.47 35.26,11.56 32.13,11.54 28.63,11.69 27.54,26.32 29.87,25.56 37.47,20.53 38.92,20.53 38.92,19.05 42.39,21.72 36.53,14.3 39.27,11.03 30.13,13.03 31.73,13.03 33.25,14.1 34.98,15.78 34.17,14.94 35.12,22.78 32.41,23.65 33.73,11.54 39.7,27.87 33.81,25.43 36.35,28.2 43.56,24.79 40.36,26.19 42.93,27.89 44.56,25.63 45.09,19.43 44.63,13.54 36.71,11.54 30.41,11.56 30.76,25.56 34.95,25.3 24.92,6.99 28.05,6.99 30.84,6.51 34.95,6.35 37.24,6.56 39.45,6.99 42.9,6.99 46.18,13.03 46.16,16.03 46.21,22.03 46.18,25.15 46.18,27.74 43.08,9.07 38.36,9.1 35.07,7.48 42.34,38.62 42.56,36.78 36.31,39.07 30.98,38.31 35.42,45.32 6.79,34.01 9.05,40.92 10.06,46.38 22.03,46.38 27.99,46.38 30.92,46.38 33.96,46.49 36.88,46.38 39.96,46.51 42.98,46.21 46.03,43.29 46,39.98 45.95,37.06 46.05,33.79 46.16,31.12 29.01,44.15 30.99,44.17 29.01,41.66 30.94,41.66 29.98,42.9 43.81,39.4 30.42,33.79 29,32.39 29.35,35.49 38.46,46.39 28.99,37.33 12.67,41.46 10.66,42.51 15.71,42.47 19.66,42.47 23.67,42.46 22.65,40.44 17.67,39.46 17.66,36.45 16.67,37.47 19.68,36.47 16.65,35.44 21.67,35.46 24.68,37.46 24.68,33.4 13.67,32.49 14.66,36.45 12.73,31.46 10.16,27.22 24.64,27.47 18.22,19.28 17.71,16.87 15.42,16.87 12.65,18.06 12.65,14.38 15.42,14.33 8.49,17.66 6.79,18.93 11.99,20.76 12.65,15.57 10.8,15.07 6.96,15.73 6.96,14.46 6.96,12.96 6.99,31.98 6.79,43.08 6.96,45.09 7.52,46.38 11.74,46.05 14.02,46.03 20.3,46.38 6.79,35.54 6.86,29.49 6.79,27.71 6.89,25.15 8.77,11.15 6.25,23.22 8.06,26.8 16.18,21.52 23.73,22.91 22.41,21.39 22.41,20.25 22.53,18.62 25.2,19.61 20.2,19.31 23.35,12.17 24.41,12.2 29.42,8.77 30.33,10.21 18.19,8.39 19.66,7.09 17.12,7.04 47.88,34.27 9.96,9.02 11.59,6.99 27.54,47.78 46.18,7.67 6.99,7.12 45.93,45.93 40.21,36.78 37.52,30.66 9.2,36.58 10.7,30.47 15.66,40.47 10.04,6.81 13.06,6.84 15.8,6.84 22.05,6.99 6.79,10.11 45.98,38.41 29.59,47.78 42.04,42.07 29.85,40.34 27.97,40.39 44.07,12.4 10.88,6.3 11.08,46.49 31.02,23.65 34.29,21.95 33.94,23.65 32.67,25.43 44.63,16.56 29.44,23.63 25.78,27.47 9.22,31.88 9.22,31.07 23.64,37.5 14.61,42.47 25.24,44.01 24.62,42.46 17.76,46.05 27.94,28.62 37.21,37.97 38.41,37.92 40.51,34.73 11.67,37.47 14.66,35.4 15.15,26.23 22.44,27.2 23.98,26.78 17.66,31.39 19.97,9.99 17.53,9.99 30.15,18.22 28.58,18.22 28.6,15.62 29.85,15.62 28.78,20.78 31.74,22.24 30.99,17.38 31.93,16.92 34.52,17.2 33.2,16.72 40.59,14.25 40.44,13.24 44.17,20.43 43.29,19.43 43.56,22.58 46.59,35.06 8.34,47.53 11.08,47.78 5.46,42.47 5.46,39.93 5.46,29.77 5.46,27.23 5.46,37.39 5.46,34.85 5.46,32.31 5.46,24.69 5.39,22.43 5.46,11.99 9.27,5.39 11.81,5.39 14.35,5.39 16.89,5.39 19.43,5.39 21.97,5.39 24.51,5.39 27.05,5.39 29.59,5.39 32.31,5.24 34.67,5.39 37.21,5.39 39.75,5.39 42.29,5.39 47.98,9.2 47.98,11.74 47.98,14.28 47.98,16.82 47.98,21.9 47.98,24.44 47.98,29.52 47.98,32.06 47.98,44.76 47.83,42.22 31.88,47.78 24.67,21.52 30.2,26.65 31.47,27.77 26.67,22.46 26.8,25.4 26.65,24.57 9.25,14.99 27.46,19.31 27.56,16.51 34.15,44.97 38.48,11.87 37.52,25.1 36.53,26.42 41.56,24.54 39.42,24.21 8.08,44.12 11.94,44.3 16.03,44.35 19.77,44.33 9,38.89 6.96,40.08 29.48,30.71 29.18,33.79 29.09,38.29 45.57,29.59 47.99,26.92 33.28,27.11 22.37,24.91 31.47,19.99 33.48,18.22 32.13,18.37 29.44,19.18 30.7,21.15
  pour Bottom: 5.08,47.91 47.92,47.91 47.92,5.07 5.07,5.06
  pour Route14: 5.08,47.91 47.92,47.91 47.92,5.07 5.07,5.06
  pour Route2: 47.92,47.91 47.92,5.07 5.07,5.06 5.08,47.91
  pour Top: 47.92,47.91 47.92,5.07 5.07,5.06 5.08,47.91
  pour Route15 (rank 2): 5.08,47.91 47.92,47.91 47.92,5.07 5.07,5.06
JTAG_RST  (via drill 0.3)
  Top 0.152: U3.7 38.71,39.65 v39.73,38.64 | B1.P$1 14.97,3.02 v14.96,2.85 | C32.P$1 21.43,44.74 21.9,44.28 22.32,44.28 v22.34,44.26 22.34,44.93
  Top 0.254: 22.34,44.93 R34.P$1
  Route2 0.152: X5.10 5.77,32.87 6.2,33.3 6.2,41.33 v6.76,41.89
  Route15 0.152: v39.73,38.64 39.68,38.64 37.82,40.49 36.85,40.49 31.67,45.67 26.78,45.67 26.34,45.24 26.34,44.23 25.15,43.03 22.4,43.03 22.34,42.97 | v14.96,2.85 14.96,5.62 15.57,6.23 16.29,6.23 16.41,6.35 20.58,6.35 21.54,7.32 21.54,9.43 20.37,10.59 11.31,10.59 8.51,13.39 8.51,16.11 6.18,18.44 6.18,22.41 5.64,22.94 5.64,23.91 6,24.26 6,32.74 5.87,32.87 X5.10 | v22.34,44.26 22.34,42.97 | 22.34,42.97 20.91,41.53 13.49,41.53 13.03,41.99 11.31,41.99 11.21,41.89 v6.76,41.89
JTAG_TCK  (via drill 0.3)
  Top 0.152: U1.C14 v23.66,30.46 | U3.49 43.05,31.29 v42.57,30.81
  Route2 0.152: 23.68,30.46 v23.66,30.46 23.75,30.46 24.06,30.15 31.93,30.15 32.39,30.61 33.91,30.61 34.42,30.1 39.37,30.08 40.31,31.04 41.03,31.04 41.25,30.81 v42.57,30.81
  Route15 0.152: v23.66,30.46 23.66,31.49 24.36,32.19 24.36,32.54 23.97,32.94 22.17,32.94 22.1,33 20.32,33 20.27,32.95 18.6,32.95 18.17,32.49 15.47,32.49 14.89,31.91 13.31,31.91 13.19,32.03 9.86,32.03 9.1,32.82 8.51,33.41 8.51,35.51 7.8,36.22 6.46,36.22 6,36.68 X5.4
JTAG_TDI  (via drill 0.3)
  Top 0.152: U1.C12 23.25,31.96 v23.67,32.4
  Route15 0.152: X5.8 5.82,34.14 7.8,32.16 7.8,31.09 8.77,30.13 9.62,30.13 10.15,29.59 11.97,29.59 12.86,30.48 13.31,30.48 13.92,31.09 16.03,31.09 16.16,30.97 16.31,30.82 18.67,30.82 19.18,31.32 21.52,31.32 22.31,32.11 23.38,32.11 v23.67,32.4
JTAG_TDO  (via drill 0.3)
  Top 0.152: U3.55 42.73,34.29 v42.19,34.83
  Route2 0.152: 42.19,34.78 v42.19,34.83 42.19,34.37 41.3,33.48 39.88,33.48 38.84,32.44 35.74,32.44 35.39,32.8 34.32,32.8 34.12,33 33.13,33 32.62,32.49 29.87,32.49 28.22,30.81 24.54,30.81 23.98,31.35 23.51,31.35 22.64,32.21 21.92,32.21 v21.67,32.47
  Route15 0.152: v21.67,32.47 21.64,32.49 21.64,32.34 21.19,31.9 18.7,31.9 18.6,31.98 16.16,31.98 15.7,31.52 13.72,31.52 13.06,30.87 12.78,30.87 11.84,29.93 10.38,29.93 10.06,30.24 9.78,30.53 8.92,30.53 8.34,31.12 8.34,32.62 7.75,33.2 7.75,34.17 7.14,34.78 6.46,34.78 5.82,35.41 X5.6
JTAG_TMS  (via drill 0.3)
  Top 0.152: U1.A15 v24.67,29.47
  Top 0.178: U3.46 40.71,30.17 v40.72,30.43
  Route2 0.152: v24.67,29.48 v24.67,29.47 25,29.8 32.57,29.8 32.97,29.39 39.68,29.39 v40.72,30.43
  Route15 0.152: v24.67,29.47 25.25,30.05 25.25,33.73 25.05,33.94 24.24,33.94 23.14,35.03 22.46,35.03 21.47,34.04 19.36,34.04 18.83,33.51 17.56,33.51 16.84,32.82 15.73,32.82 15.5,33.05 13.31,33.05 12.65,32.39 10.21,32.39 9.76,32.82 9.76,35.13 9.63,35.26 8.49,36.3 8.49,36.86 7.4,37.95 X5.2
MAX_ANT_FLAG  (via drill 0.3)
  Top 0.152: U10.1 35.85,22.3 v35.87,22.38
  Top 0.178: U3.25 33.24,34.79 34.52,36.07 36.45,36.07 v37.47,37.09
  Top 0.279: U10.1
  Route2 0.152: v37.47,37.09 38.97,37.09 40.26,38.38 40.26,41.18 37.75,43.69 32.21,43.69 30.71,42.19 28.78,42.19 28.22,41.63 25.43,41.63 25.1,41.3 24.21,41.3 23.91,41 14.36,41 13.06,42.3 11.33,42.3 10.72,41.69 10.72,36.17 13.21,33.68 13.21,33.23 11.99,32.01 11.41,32.01 10.14,30.74 10.14,30.23 10.72,29.65 11.83,29.65 13.28,31.09 15,31.09 v15.74,30.46 15.69,30.45
  Route15 0.152: v35.87,22.38 35.87,22.81 34.27,24.41 32.08,24.41 31.45,25.05 31.45,26.93 30.81,27.56 26.78,27.56 25.99,28.35 22.81,28.35 21.98,29.19 21.77,29.19 19.97,30.99 19.38,30.99 18.83,30.43 v15.74,30.46
MAX_CLKOUT  (via drill 0.3)
  Top 0.152: U1.J14 v17.59,29.45 | U10.16 40.97,18.8 41.08,18.7 43.03,18.7 arc-90 v43.06,18.67
  Top 0.279: U10.16
  Route15 0.152: 17.67,29.44 v17.59,29.45 19.1,28.02 19.1,26.6 21.75,23.96 24.57,23.96 24.92,23.6 24.92,22.91 26.37,21.47 27.33,21.47 27.61,21.19 27.61,20.1 29.32,18.39 29.32,17.99 29.7,17.61 30.38,17.61 30.79,18.01 31.45,18.01 31.83,17.63 33.76,17.63 34.37,18.24 36.2,18.24 36.53,17.91 41.96,17.91 42.73,18.67 v43.06,18.67
MAX_I0  (via drill 0.3)
  Top 0.152: U1.E16 v21.67,27.45
  Top 0.254: U10.20 41.49,20.8 v41.58,20.71
  Top 0.279: U10.20
  Route15 0.152: 21.67,27.44 v21.67,27.45 21.67,27.12 21.7,27.1 22.98,25.79 24.35,25.79 25.1,25.05 25.1,24.79 26.55,23.35 27.16,23.35 28.53,21.98 30.71,21.98 31.63,21.06 41.18,21.06 v41.58,20.71
MAX_I1  (via drill 0.3)
  Top 0.152: U1.E15 v21.67,28.45
  Top 0.254: 40.57,21.3 41.11,21.3 v41.58,21.77
  Top 0.279: U10.21 40.57,21.3 U10.21
  Route15 0.152: v41.58,21.77 41.2,21.39 31.78,21.39 30.84,22.33 28.66,22.33 27.33,23.65 26.67,23.65 25.45,24.87 25.45,25.33 24.66,26.13 23.42,26.13 23.05,26.55 23.05,27.76 22.82,27.99 22.13,27.99 v21.67,28.45 21.67,28.43
MAX_LD  (via drill 0.3)
  Top 0.152: U10.6 35.29,18.8 35.16,18.67 35.16,17.28 v35.82,16.62
  Top 0.178: U3.41 38.21,30.47 39.53,31.8 39.53,33.66 v39.93,34.07
  Top 0.279: U10.6
  Route15 0.152: v35.82,16.62 35.82,15.7 33.63,13.52 32.54,13.52 32.36,13.34 32.36,12.6 32.97,11.99 32.97,11.38 33.43,10.93 38.38,10.93 40.14,12.68 40.77,12.68 41.41,13.31 43.18,13.31 44.02,14.15 45.29,14.15 47.43,16.29 47.43,25.51 45.88,27.05 41.23,27.05 40.44,27.87 40.44,28.81 39.76,29.49 39.76,33.89 v39.93,34.07
MAX_NIDLE  (via drill 0.3)
  Top 0.152: U10.24 38.69,22.61 39.25,23.17 40.64,23.17 v40.77,23.02
  Top 0.178: U3.29 32.44,32.79 | 32.44,32.79 33.22,32.79 33.91,33.48 v34.62,33.48 34.52,33.38 34.52,31.47 33.66,30.61 33.1,30.61 32.33,29.84 R12.P$1 | 32.44,32.8 32.44,32.79
  Top 0.279: U10.24
  Route15 0.152: v34.62,33.48 33.33,33.48 31.96,32.11 31.96,29.04 32.67,28.35 33.35,28.35 34.09,27.61 34.09,26.95 34.6,26.45 34.88,26.45 37.24,24.08 38.21,24.08 39.27,23.02 v40.77,23.02
MAX_NSHDN  (via drill 0.3)
  Top 0.152: U10.7 35.85,18.17 v35.85,17.64 | U3.62 44.8,37.79 R19.P$1 45.06,37.04 v44.99,36.96
  Top 0.279: U10.7
  Route2 0.152: 35.95,46.54 v35.97,46.51 35.82,46.51 35.13,45.83 32.59,45.83 32.24,45.47 17.23,45.47 17.15,45.55 14.33,45.55 14.05,45.27 8.41,45.27 7.52,44.38 7.52,27.36 7.27,27.11 7.27,26.17 7.78,25.66 7.78,24.49 8.72,23.55 8.72,19.87 7.8,18.95 7.8,13.26 11.89,9.17 16.23,9.17 18.98,6.43 23.07,6.43 v23.42,6.79
  Route15 0.152: v35.86,17.64 v35.85,17.64 35.81,17.64 34.27,16.11 30.61,16.11 30.05,16.67 28.45,16.67 27.89,17.23 26.75,17.23 26.22,17.76 26.22,19.74 25.79,20.17 24.72,20.17 23.91,19.36 23.91,14.69 21.95,12.73 21.95,8.92 23.42,7.45 v23.42,6.79 | 44.96,36.99 v44.99,36.96 44.99,37.22 35.97,46.23 v35.97,46.51
MAX_PGM  (via drill 0.3)
  Top 0.152: v37.52,31.42 38.97,32.77 38.97,33.96 42.32,37.32 43.06,37.32 | U10.26 37.73,22.18 37.73,23.38 38.51,24.16 38.71,24.16 38.89,24.34 38.89,24.57 39.09,24.77 40.01,24.77 40.95,25.71 40.95,26.52 40.52,26.95 40.52,27.92 40.03,28.4 38.97,28.4 v38.79,28.22 38.74,28.17 R20.P$2
  Top 0.178: U3.61 43.69,37.29 43.06,37.32
  Route15 0.152: v38.79,28.22 38.79,30.66 38.03,31.42 v37.52,31.42
MAX_Q0  (via drill 0.3)
  Top 0.152: U1.F15 19.66,28.45 v19.66,28.53 | U10.18 41.04,19.8 41.28,19.61 v41.56,19.61
  Top 0.279: U10.18
  Route15 0.152: 19.66,28.46 v19.66,28.53 20.1,28.55 21.06,27.59 21.06,27.16 23.6,24.62 24.82,24.62 26.42,23.02 26.98,23.02 28.6,21.39 29.7,21.39 30.48,20.6 31.65,20.6 32.87,19.38 36.2,19.38 37.06,18.52 40.57,18.52 v41.56,19.61
MAX_Q1  (via drill 0.3)
  Top 0.152: U10.17 41,19.3 41.25,19.05 41.89,19.05 v42.35,19.51 | U1.F16 v19.66,27.45
  Top 0.279: U10.17
  Route15 0.152: 19.66,27.46 v19.66,27.45 19.66,26.57 21.95,24.29 24.69,24.29 25.38,23.6 25.38,22.94 26.52,21.8 27.51,21.8 27.94,21.37 27.94,20.76 28.53,20.17 29.62,20.17 31.12,18.67 31.63,18.67 31.98,19.03 36,19.03 36.81,18.21 41.15,18.21 42.35,19.41 v42.35,19.51
N$2
  Top 0.203: 34.68,24.52 U9.4
  Top 0.279: L4.P$2 34.68,24.52
N$3
  Top 0.279: R2.P$1 38.58,13.26 C18.P$1
N$4
  Top 0.279: 39.15,15.29 39.15,16.13 38.69,16.59 U10.12 | 39.15,15.29 C19.P$1 | R2.P$2 39.14,15.29 39.15,15.29
N$5
  Top 0.203: U10.2 35.44,20.8 35.08,21.04
  Top 0.279: 35.08,21.04 31.86,21.04 arc48 U8.1
N$6
  Top 0.152: U10.15 40.48,18.3 | U10.15 41.67,18.3 C20.P$1
  Top 0.279: U10.15
N$7
  Top 0.279: U8.4 arc51 32.34,17.5 arc90 34.6,18.62 34.68,18.77 35.2,19.3 U10.5
N$8
  Top 0.229: 43.84,23.65 C14.P$1 43.8,23.69
  Top 0.279: J1.P1 47.48,23.52 47.35,23.65 44.94,23.65 L3.P$1 43.76,23.73 C14.P$1
N$9
  Top 0.203: C34.P$1 9.17,26.06 9.57,25.66 9.57,25.49 10.19,24.9 10.33,24.76 X4.2 10.19,23.32 10.19,21.31 10.62,20.88 10.65,20.88 10.65,19.61 11.22,19.04 U7.2
N$10  (via drill 0.3)
  Top 0.152: 29.46,21.85 C41.P$2 | 28.37,21.85 C36.P$2 | 28.34,22.82 L1.P$1
  Top 0.279: U10.3 34.92,20.3 34.9,20.32 v34.9,20.4 | C12.P$2 45.11,21.75 v44.96,21.9 44.84,21.9 | C13.P$2 44.64,21.9 44.84,21.9 | 44.84,21.9 44.86,21.92 L3.P$2
  Top 0.305: v30.23,23.98 30.23,22.36 29.72,21.85 29.46,21.85 28.37,21.85 | C36.P$2 28.34,22.82
  Route2 0.279: v34.9,20.4 34.88,20.4
  Route15 0.152: 41.38,22.33 40.8,21.72 40.11,21.72 40.01,21.82 | 34.12,22.96 35.36,21.72 36.15,21.72 36.25,21.82
  Route15 0.178: 42.69,20.16 41.19,20.16
  Route15 0.203: 41.53,22.48 41.38,22.33
  Route15 0.254: 40.01,21.82 36.25,21.82
  Route15 0.305: 41.19,20.16 40.8,19.77 36.76,19.77 36.12,20.4 v34.9,20.4 | 42.69,20.16 43.21,20.68 43.21,21.9 | v44.96,21.9 43.21,21.9 | v30.23,23.98 30.23,23.37 30.64,22.96 34.12,22.96 | 43.21,21.9 42.63,22.48 41.53,22.48
N$11
  Top 0.279: C95.P$2 37.19,22.84 U10.27 arc269 U10.27
N$14
  Top 0.152: U5.1
  Top 0.254: L1.P$2 U5.1
  Top 0.279: C16.P$1 U5.1
N$15
  Top 0.178: 11.05,19.82 11.05,19.79 11.29,19.56 11.62,19.56
  Top 0.203: U7.1 11.62,19.56 | 11.05,19.82 11.05,22.53 12.88,24.36 14.12,24.36 X4.1 14.42,23.98
  Top 0.254: C35.P$1 15.66,23.16 14.69,23.98 14.68,23.98 14.42,23.98
N$16
  Top 0.152: U2.8 23.68,13.51 23.88,13.31 25.43,13.31 26.14,12.6 R1.P$1
N$17
  Top 0.254: U2.4 24.18,9.96 24.16,9.94
  Top 0.406: 24.16,9.94 24.16,9.78
  Top 0.61: 24.16,9.78 24.16,9.45 24.11,9.41 L13.2
N$18  (via drill 0.3)
  Top 0.152: U3.26 33.28,34.29 34.27,35.28 v34.83,35.28 | v8.87,25.25 8.81,25.19 R10.P$1
  Route2 0.152: 34.83,35.31 v34.83,35.28 35.51,35.97 38.51,35.97 40.59,38.05 40.59,41.38 37.95,44.02 32.08,44.02 31.25,43.18 30.56,43.18 30.28,43.46 29.57,43.46 28.07,41.96 25.28,41.96 24.95,41.63 24.06,41.63 23.75,41.33 15.85,41.33 15.17,42.02 15.17,42.7 14.84,43.03 11.05,43.03 11,43.08 10.42,43.08 10.11,42.78 10.11,41.96 10.42,41.66 10.42,35.16 9.99,34.73 9.99,31.09 9.76,30.87 9.76,29.39 9,28.63 9,25.38 v8.87,25.25
N$19
  Top 0.178: U7.38 17.69,21.2 17.76,21.26 20.27,21.26 C49.P$1
N$20  (via drill 0.3)
  Top 0.152: U7.31 20.07,17.04 v20.25,17.23 20.57,17.54 R9.P$2
N$21
  Top 0.152: 10.68,16.04 C68.P$1 | 10.09,14.63 C65.P$2
  Top 0.254: U7.8 10.68,16.04 | L11.P$2 10.09,14.63 | C65.P$2 10.02,15.38 C68.P$1
N$22
  Top 0.254: 34.09,19.04 L2.P$1 33.98,19.82 C38.P$1
  Top 0.279: U10.4 34.21,19.8 C38.P$1
N$23  (via drill 0.3)
  Top 0.152: U6.5 25.25,23.19 24.82,23.19 24.64,23.37 v24.34,23.4 24.34,24.06 22.99,25.4 22.99,25.92 R4.P$2
  Top 0.178: U7.45 14.19,22.42 v14.61,22.84
  Route15 0.152: 14.63,22.86 v14.61,22.84 | 14.63,22.76 14.96,23.09 23.12,23.09 23.55,23.52 24.21,23.52 v24.34,23.4
  Route15 0.178: v14.61,22.84 14.63,22.76
N$24  (via drill 0.3)
  Top 0.152: v30.28,1.38 30.18,1.38 LED1.A | v40.09,11.13 40.09,11.14
  Top 0.254: 40.09,11.14 R30.P$1
  Route15 0.152: v30.28,1.38 30.84,1.93 30.84,5.29 33.79,8.23 38.89,8.23 40.09,9.43 v40.09,11.13
N$25  (via drill 0.3)
  Top 0.152: R5.P$2 26.48,21.05 | 26.5,20.83 R5.P$2 | 25.64,22.04 25.29,22.04 U6.4 25.8,22.21 26.48,21.53 R5.P$2 | v27.06,20.86 26.47,20.86 R5.P$2 | 14.69,20.88 14.69,21.75 15.37,22.43 v15.93,22.43
  Top 0.178: U7.44 14.69,20.86 14.69,20.88
  Route15 0.152: v27.06,20.86 26.45,20.86 24.95,22.36 23.14,22.36 22.79,22.71 16.21,22.71 v15.93,22.43
N$26
  Top 0.152: 24.18,15.27 24.16,15.27
  Top 0.254: 24.11,15.22 24.13,15.24 | U2.7 24.18,14.6 24.18,14.61
  Top 0.305: 24.13,15.24 24.16,15.27 24.47,15.58 L14.1
  Top 0.406: 24.18,14.61 24.18,15.27 24.21,15.29
N$27  (via drill 0.3)
  Top 0.152: 22.5,22.38 U6.3 | U6.3 22.85,21.89 23.07,21.67 | 23.07,21.67 v23.8,21.67 | 23.07,21.67 23.07,20.85 R6.P$2 | R3.P$1 22.22,22.24 U6.3
  Top 0.178: U7.43 15.19,21.31 v15.4,21.44
  Route15 0.152: v15.4,21.44 15.93,20.96 20.88,20.96 21.85,21.92 23.5,21.92 23.75,21.67 v23.8,21.67
N$28
  Top 0.152: 23.17,24.29 23.02,24.14 U6.1 22.22,24.14 R3.P$2
N$29  (via drill 0.3)
  Top 0.152: C59.P$2 9.71,20.21
  Top 0.178: U7.3
  Top 0.203: L10.P$2 8.39,21.6 8.66,21.6 | 10.88,18.55 v10.8,18.62 | C59.P$2 9.84,20.42 | 9.84,18.86 9.71,18.86 C64.P$1
  Top 0.254: U7.3 10.88,18.55 | 8.66,21.6 9.84,20.42 | 9.84,18.86 10.56,18.86 v10.8,18.62 | 9.71,20.21 9.71,18.86
  Route3 0.178: v10.8,18.62 10.77,18.85
N$30
  Top 0.279: C14.P$2 42.5,23.65 40.26,23.65 39.3,23.58 39.09,23.55 39.02,23.52 38.69,23.3 38.41,23.02 38.19,22.64 38.19,22.23 U10.25 38.21,22.16
N$31
  Top 0.152: U1.C4 23.68,40.47 23.68,41.23 23.91,41.46 25.43,41.46 25.78,41.81 25.78,44.55 25.6,44.69 R18.P$2
N$32
  Top 0.178: C75.P$1 20.12,20.35 | 18.23,20.58 U7.37
  Top 0.254: 20.12,20.35 19.89,20.58 18.23,20.58
N$33
  Top 0.203: U7.5 10.94,17.54 10.8,17.68 R7.P$1
N$34
  Top 0.152: U1.P14 11.65,29.44 9.86,29.44 8.89,28.48 R14.P$1
N$35
  Top 0.279: L4.P$1 32.33,24.52 L5.P$2 31.73,24.54 C16.P$2
N$36
  Top 0.203: 35.23,23.63 U9.2
  Top 0.305: C95.P$1 35.23,23.63
N$39  (via drill 0.3)
  Top 0.152: LED1.C 30.24,2.89 v30.28,2.87
  Top 0.178: U3.24 33.13,35.29 34.34,36.5 35.89,36.5 v36.1,36.71
  Route2 0.152: 46.18,29.06 v46.18,29.04 44.38,29.04 43.64,29.77 42.09,29.77 41.41,29.09 28.38,29.09 27.97,29.49 25.48,29.49 24.57,28.58 23.93,28.58 22.99,27.64 22.99,26.78 21.8,25.58 21.8,21.8 21.85,21.75 21.85,14.58 21.24,13.97 20.68,13.97 20.32,14.33 18.93,14.33 18.32,13.72 18.32,11.18 18.85,10.65 22.99,10.65 23.88,11.54 23.88,12.47 24.13,12.73 27.39,12.73 27.97,12.14 27.97,11.05 30.23,8.79 v30.28,2.87
  Route15 0.152: v36.1,36.71 36.68,36.71 37.52,35.87 40.34,35.87 43.54,32.67 43.54,30.59 45.09,29.04 v46.18,29.04
N$41
  Top 0.203: 34.7,23.37 34.7,23.6 U9.1
  Top 0.279: 34.7,23.37 34.18,22.85 C47.P$2 C15.P$2 31,22.85 R11.P$1
N$53
  Top 0.152: C1.P$1 16.4,9.47 16.79,9.48 16.82,9.48 R62.P$1 17.35,9.42 16.82,9.43
  Top 0.203: U2.1 22.1,10.45 21.75,10.8 18.39,10.8 18.09,10.49 18.09,9.73 17.78,9.43 16.82,9.43
  Top 0.254: R61.P$1 C1.P$1
N$54
  Top 0.152: 22.64,14.13 22.64,13.99 U2.10
  Top 0.305: R63.P$1 R64.P$1 | R64.P$1 | R64.P$1 22.2,15.42 C5.P$2 22.19,14.57 22.64,14.13
N$55  (via drill 0.3)
  Top 0.152: v36.28,1.35 36.2,1.35 LED2.A | R28.P$2
  Top 0.254: v42.96,11.13 R28.P$2
  Route15 0.152: v36.28,1.35 35.72,1.91 35.72,6.76 36.58,7.62 39.45,7.62 v42.96,11.13
N$56
  Top 0.152: 39.04,25.18 39.25,25.15 U12.3 39.34,25.18
  Top 0.279: 38.49,25.18 C7.P$2 | R65.P$2 38.15,27.13 38.16,27.14
  Top 0.305: 39.04,25.18 38.49,25.18 | R65.P$2 C9.P$1 38.15,25.13 38.31,24.97 38.29,24.96 C7.P$2 | U12.1 38.16,27.14
N$59  (via drill 0.3)
  Top 0.152: U3.11 36.71,41.77 v36.71,41.88 | LED2.C v36.26,2.86 v36.28,2.87
  Route2 0.152: v46.16,30.1 46.16,29.95 46.84,29.26 46.84,28.81 46.41,28.38 45.95,28.38 45.67,28.66 42.32,28.66 42.22,28.76 28.83,28.76 28.07,27.99 26.29,27.99 26.17,28.12 24.26,28.12 23.35,27.21 23.35,26.55 23.19,26.39 23.19,19.49 29.57,13.11 29.57,10.01 30.94,8.64 35.41,8.64 36.28,7.78 v36.28,2.87
  Route15 0.152: v36.71,41.88 37.62,40.97 39.17,40.97 40.52,39.63 40.52,39.35 41.25,38.61 41.25,36.96 44.38,33.84 44.38,30.79 44.89,30.28 45.98,30.28 v46.16,30.1
SPI1MISO  (via drill 0.3)
  Top 0.152: v26.1,32.05 26.01,31.96 U1.A12
  Top 0.178: U3.22 33.04,36.29 34.47,37.72 35.36,37.72 35.51,37.88 v36.3,37.88
  Route2 0.152: v36.3,37.88 36.22,37.88 35.51,37.16 35.51,36.76 35.13,36.38 34.12,36.38 32.08,34.34 28.66,34.34 26.36,32.05 v26.1,32.05 26.25,32.05
SPI1MOSI  (via drill 0.3)
  Top 0.152: 23.17,32.98 U1.C11 23.65,33.44 v23.73,33.47
  Top 0.178: U3.23 33.08,35.79 34.4,37.11 v34.93,37.11
  Route2 0.152: v34.93,37.11 34.29,37.11 31.83,34.65 28.35,34.65 26.29,32.59 25.43,32.59 25.18,32.85 24.41,32.85 23.68,33.58 v23.73,33.47
SPI1NSS  (via drill 0.3)
  Top 0.152: U1.A10 25.17,33.95 25.32,33.95 v25.82,33.44
  Top 0.178: U3.20 32.97,37.29 33.74,38.05 v33.74,38.41
  Route2 0.152: 25.67,33.45 v25.82,33.44 26.06,33.68 26.32,33.68 28.68,36.05 31.37,36.05 v33.74,38.41
SPI1SCK  (via drill 0.3)
  Top 0.152: U1.B10 24.17,34.05 v24.65,34.52
  Top 0.178: U3.21 32.98,36.79 34.47,38.28 34.9,38.28 v34.98,38.36
  Route2 0.152: v34.98,38.36 34.98,38.28 31.63,34.95 28.15,34.95 26.09,32.9 25.61,32.9 25.25,33.25 25.25,33.94 v24.65,34.52 24.68,34.46
SPI2MISO  (via drill 0.3)
  Top 0.152: U1.P10 v12.67,33.47
  Top 0.178: U3.35 35.21,31.88 v35.13,32.06
  Top 0.254: v32.15,42.87 32.35,42.87 U13.2